# Altium project DUTBoard.PrjPcb (part 1 of 5)
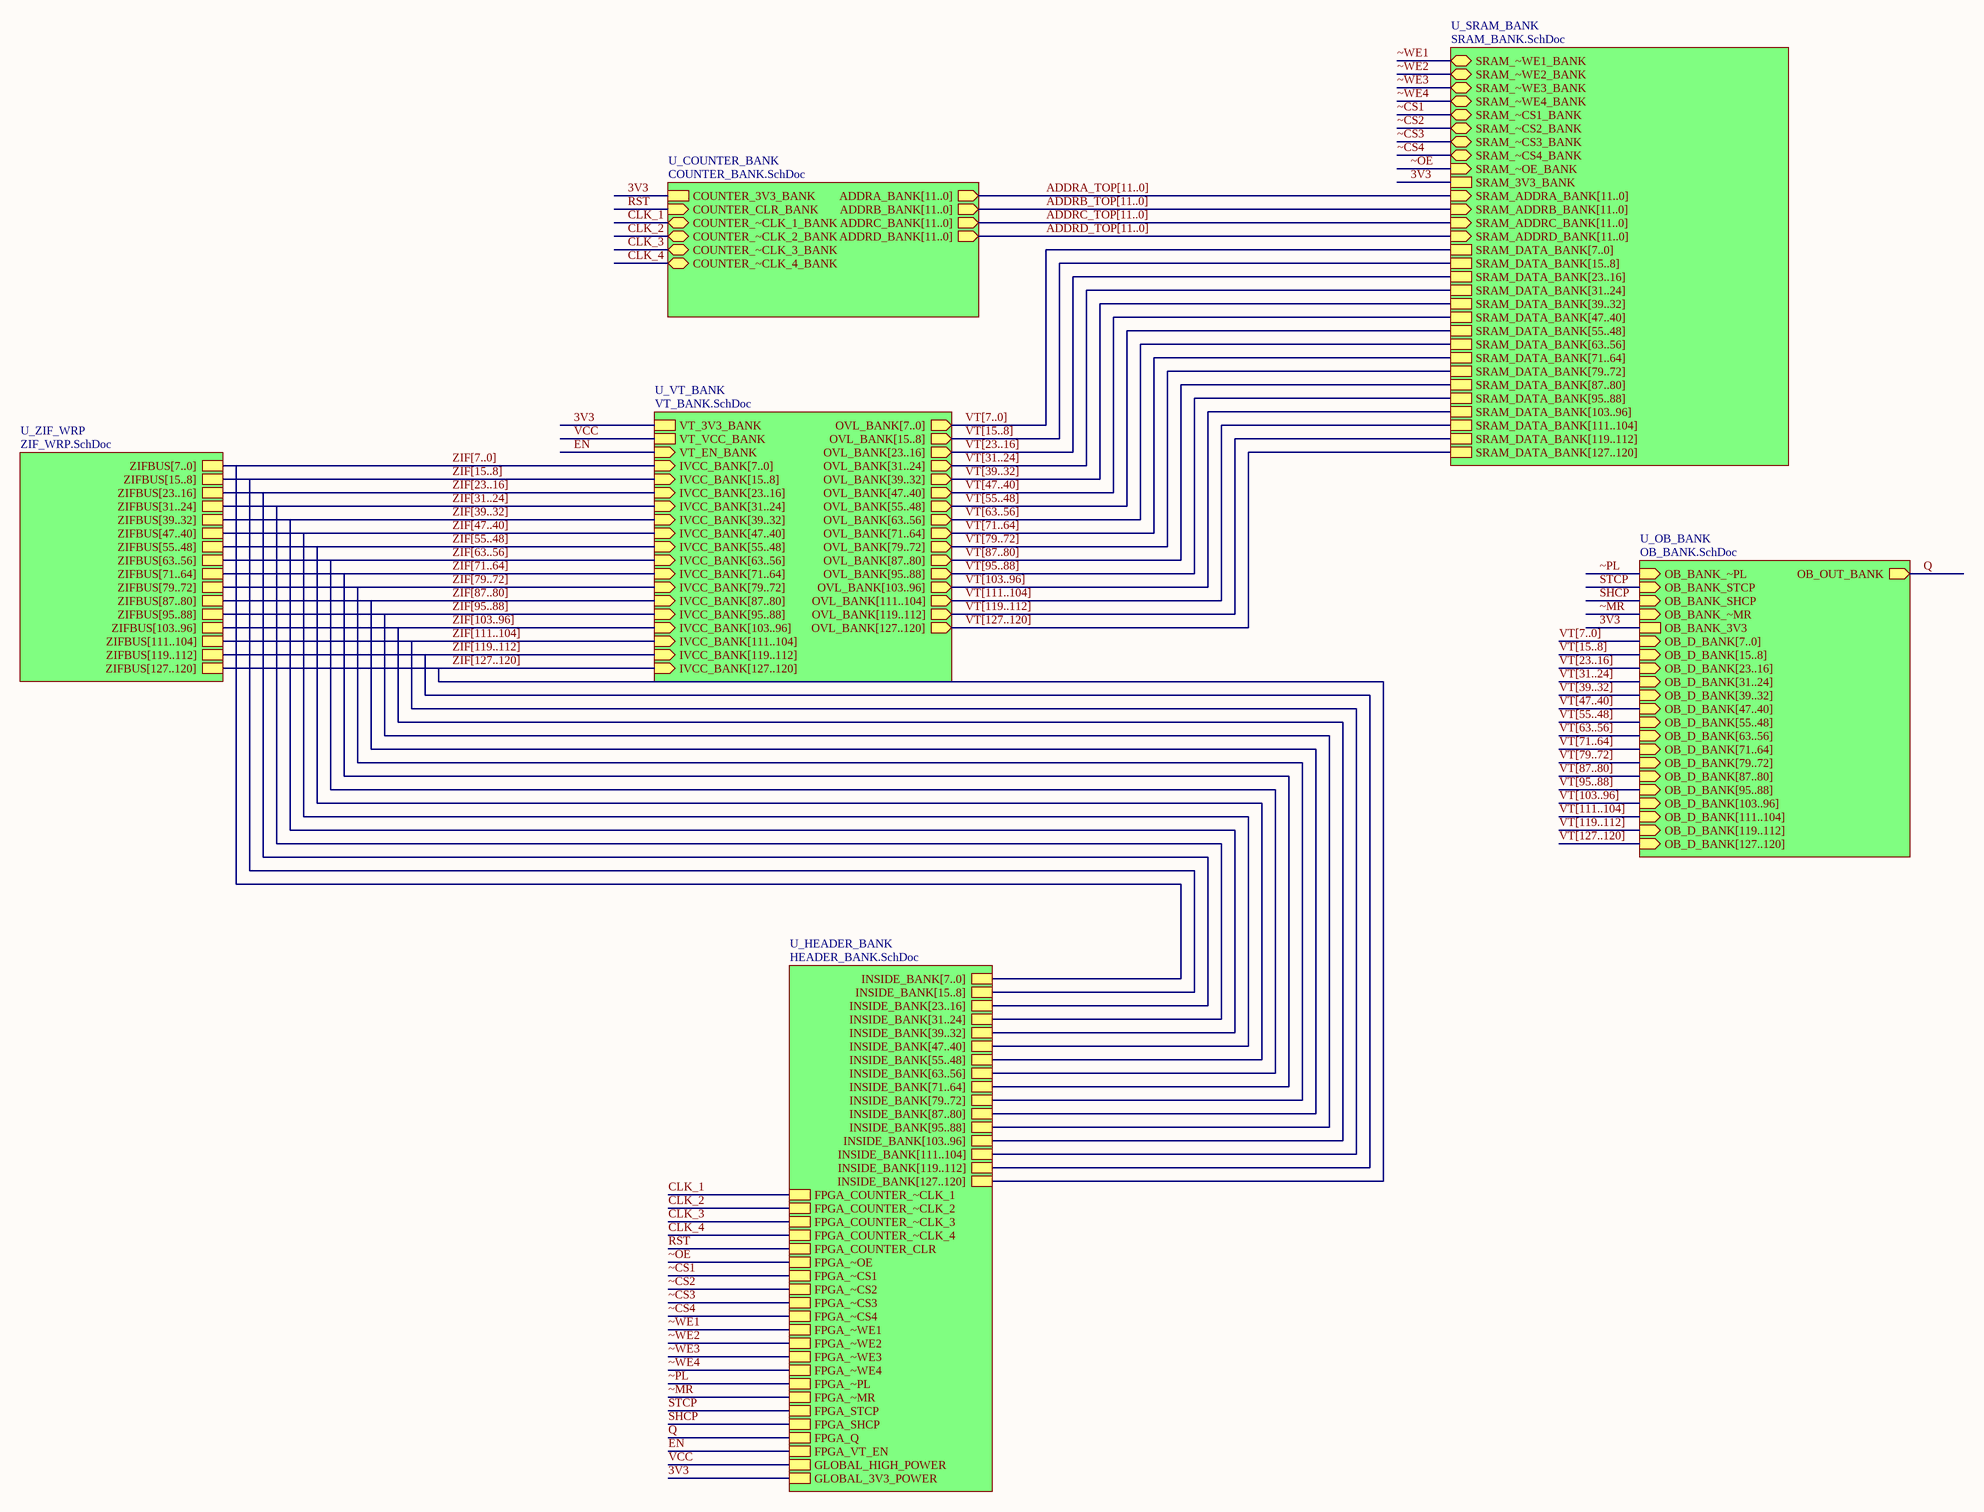
[diagram p0: TOP.SchDoc]
14 sheets, 89 parts. Net scope: hierarchical (ports join the sheet entries above them; power ports are global).
Board file: DUTBoard.PcbDoc
Sheets:
  TOP.SchDoc
    U_COUNTER_BANK = COUNTER_BANK.SchDoc
      U_COUNTER_WRP = COUNTER_WRP.SchDoc
      U_COUNTER_WRP = COUNTER_WRP.SchDoc
      U_COUNTER_WRP = COUNTER_WRP.SchDoc
      U_COUNTER_WRP = COUNTER_WRP.SchDoc
    U_VT_BANK = VT_BANK.SchDoc
      U_VT_WRP = VT_WRP.SchDoc
      U_VT_WRP = VT_WRP.SchDoc
      U_VT_WRP = VT_WRP.SchDoc
      U_VT_WRP = VT_WRP.SchDoc
      U_VT_WRP = VT_WRP.SchDoc
      U_VT_WRP = VT_WRP.SchDoc
      U_VT_WRP = VT_WRP.SchDoc
      U_VT_WRP = VT_WRP.SchDoc
      U_VT_WRP = VT_WRP.SchDoc
      U_VT_WRP = VT_WRP.SchDoc
      U_VT_WRP = VT_WRP.SchDoc
      U_VT_WRP = VT_WRP.SchDoc
      U_VT_WRP = VT_WRP.SchDoc
      U_VT_WRP = VT_WRP.SchDoc
      U_VT_WRP = VT_WRP.SchDoc
      U_VT_WRP = VT_WRP.SchDoc
    U_OB_BANK = OB_BANK.SchDoc
      U_OB_WRP = OB_WRP.SchDoc
      U_OB_WRP = OB_WRP.SchDoc
      U_OB_WRP = OB_WRP.SchDoc
      U_OB_WRP = OB_WRP.SchDoc
      U_OB_WRP = OB_WRP.SchDoc
      U_OB_WRP = OB_WRP.SchDoc
      U_OB_WRP = OB_WRP.SchDoc
      U_OB_WRP = OB_WRP.SchDoc
      U_OB_WRP = OB_WRP.SchDoc
      U_OB_WRP = OB_WRP.SchDoc
      U_OB_WRP = OB_WRP.SchDoc
      U_OB_WRP = OB_WRP.SchDoc
      U_OB_WRP = OB_WRP.SchDoc
      U_OB_WRP = OB_WRP.SchDoc
      U_OB_WRP = OB_WRP.SchDoc
      U_OB_WRP = OB_WRP.SchDoc
    U_SRAM_BANK = SRAM_BANK.SchDoc
      U_SRAM_WRP = SRAM_WRP.SchDoc
      U_SRAM_WRP = SRAM_WRP.SchDoc
      U_SRAM_WRP = SRAM_WRP.SchDoc
      U_SRAM_WRP = SRAM_WRP.SchDoc
      U_SRAM_WRP = SRAM_WRP.SchDoc
      U_SRAM_WRP = SRAM_WRP.SchDoc
      U_SRAM_WRP = SRAM_WRP.SchDoc
      U_SRAM_WRP = SRAM_WRP.SchDoc
    U_ZIF_WRP = ZIF_WRP.SchDoc
    U_HEADER_BANK = HEADER_BANK.SchDoc
      U_COMBINED_HEADER_WRP = COMBINED_HEADER_WRP.SchDoc
        U_TOP_HEADER_WRP = TOP_HEADER_WRP.SchDoc
        U_TOP_HEADER_WRP = TOP_HEADER_WRP.SchDoc
        U_BOTTOM_HEADER_WRP = BOTTOM_HEADER_WRP.SchDoc
      U_COMBINED_HEADER_WRP = COMBINED_HEADER_WRP.SchDoc
        U_TOP_HEADER_WRP = TOP_HEADER_WRP.SchDoc
        U_TOP_HEADER_WRP = TOP_HEADER_WRP.SchDoc
        U_BOTTOM_HEADER_WRP = BOTTOM_HEADER_WRP.SchDoc
      U_COMBINED_HEADER_WRP = COMBINED_HEADER_WRP.SchDoc
        U_TOP_HEADER_WRP = TOP_HEADER_WRP.SchDoc
        U_TOP_HEADER_WRP = TOP_HEADER_WRP.SchDoc
        U_BOTTOM_HEADER_WRP = BOTTOM_HEADER_WRP.SchDoc
      U_COMBINED_HEADER_WRP = COMBINED_HEADER_WRP.SchDoc
        U_TOP_HEADER_WRP = TOP_HEADER_WRP.SchDoc
        U_TOP_HEADER_WRP = TOP_HEADER_WRP.SchDoc
        U_BOTTOM_HEADER_WRP = BOTTOM_HEADER_WRP.SchDoc

## Sheet TOP.SchDoc
size C; DocumentNumber: 1; SheetNumber: 1; SheetTotal: 13

### Sub-sheets
U_COUNTER_BANK = COUNTER_BANK.SchDoc: ADDRA_BANK[11..0], ADDRB_BANK[11..0], ADDRC_BANK[11..0], ADDRD_BANK[11..0], COUNTER_3V3_BANK, COUNTER_CLR_BANK, COUNTER_~CLK_3_BANK, COUNTER_~CLK_2_BANK, COUNTER_~CLK_1_BANK, COUNTER_~CLK_4_BANK
U_HEADER_BANK = HEADER_BANK.SchDoc: INSIDE_BANK[7..0], INSIDE_BANK[15..8], INSIDE_BANK[23..16], INSIDE_BANK[31..24], INSIDE_BANK[39..32], INSIDE_BANK[47..40], INSIDE_BANK[55..48], INSIDE_BANK[63..56], INSIDE_BANK[71..64], INSIDE_BANK[79..72], INSIDE_BANK[87..80], INSIDE_BANK[95..88], INSIDE_BANK[103..96], INSIDE_BANK[111..104], INSIDE_BANK[119..112], INSIDE_BANK[127..120], FPGA_COUNTER_~CLK_2, FPGA_COUNTER_~CLK_3, FPGA_COUNTER_~CLK_4, FPGA_~CS1, FPGA_~OE, FPGA_~WE1, FPGA_~PL, FPGA_~MR, FPGA_STCP, FPGA_SHCP, FPGA_VT_EN, GLOBAL_HIGH_POWER, GLOBAL_3V3_POWER, FPGA_Q, FPGA_~CS2, FPGA_~WE2, FPGA_~CS3, FPGA_~WE3, FPGA_~CS4, FPGA_~WE4, FPGA_COUNTER_~CLK_1, FPGA_COUNTER_CLR
U_OB_BANK = OB_BANK.SchDoc: OB_OUT_BANK, OB_BANK_~PL, OB_BANK_STCP, OB_BANK_SHCP, OB_BANK_~MR, OB_BANK_3V3, OB_D_BANK[7..0], OB_D_BANK[15..8], OB_D_BANK[23..16], OB_D_BANK[31..24], OB_D_BANK[39..32], OB_D_BANK[47..40], OB_D_BANK[55..48], OB_D_BANK[63..56], OB_D_BANK[71..64], OB_D_BANK[79..72], OB_D_BANK[87..80], OB_D_BANK[95..88], OB_D_BANK[103..96], OB_D_BANK[111..104], OB_D_BANK[119..112], OB_D_BANK[127..120]
U_SRAM_BANK = SRAM_BANK.SchDoc: SRAM_~OE_BANK, SRAM_3V3_BANK, SRAM_ADDRA_BANK[11..0], SRAM_ADDRB_BANK[11..0], SRAM_ADDRC_BANK[11..0], SRAM_ADDRD_BANK[11..0], SRAM_DATA_BANK[7..0], SRAM_DATA_BANK[23..16], SRAM_DATA_BANK[39..32], SRAM_DATA_BANK[55..48], SRAM_DATA_BANK[71..64], SRAM_DATA_BANK[87..80], SRAM_DATA_BANK[103..96], SRAM_DATA_BANK[119..112], SRAM_DATA_BANK[15..8], SRAM_DATA_BANK[31..24], SRAM_DATA_BANK[47..40], SRAM_DATA_BANK[63..56], SRAM_DATA_BANK[79..72], SRAM_DATA_BANK[95..88], SRAM_DATA_BANK[111..104], SRAM_DATA_BANK[127..120], SRAM_~CS3_BANK, SRAM_~WE2_BANK, SRAM_~WE3_BANK, SRAM_~WE1_BANK, SRAM_~WE4_BANK, SRAM_~CS4_BANK, SRAM_~CS1_BANK, SRAM_~CS2_BANK
U_VT_BANK = VT_BANK.SchDoc: VT_3V3_BANK, VT_VCC_BANK, VT_EN_BANK, OVL_BANK[7..0], OVL_BANK[15..8], OVL_BANK[23..16], OVL_BANK[31..24], OVL_BANK[39..32], OVL_BANK[47..40], OVL_BANK[55..48], OVL_BANK[63..56], OVL_BANK[71..64], OVL_BANK[79..72], OVL_BANK[87..80], OVL_BANK[95..88], OVL_BANK[103..96], OVL_BANK[111..104], OVL_BANK[119..112], OVL_BANK[127..120], IVCC_BANK[7..0], IVCC_BANK[15..8], IVCC_BANK[23..16], IVCC_BANK[31..24], IVCC_BANK[39..32], IVCC_BANK[47..40], IVCC_BANK[55..48], IVCC_BANK[63..56], IVCC_BANK[71..64], IVCC_BANK[79..72], IVCC_BANK[87..80], IVCC_BANK[95..88], IVCC_BANK[103..96], IVCC_BANK[111..104], IVCC_BANK[119..112], IVCC_BANK[127..120]
U_ZIF_WRP = ZIF_WRP.SchDoc: ZIFBUS[7..0], ZIFBUS[15..8], ZIFBUS[23..16], ZIFBUS[31..24], ZIFBUS[71..64], ZIFBUS[79..72], ZIFBUS[87..80], ZIFBUS[95..88], ZIFBUS[103..96], ZIFBUS[111..104], ZIFBUS[119..112], ZIFBUS[127..120], ZIFBUS[39..32], ZIFBUS[47..40], ZIFBUS[55..48], ZIFBUS[63..56]

### Nets
3V3: sheet U_COUNTER_BANK/COUNTER_3V3_BANK, sheet U_VT_BANK/VT_3V3_BANK, sheet U_OB_BANK/OB_BANK_3V3, sheet U_SRAM_BANK/SRAM_3V3_BANK, sheet U_HEADER_BANK/GLOBAL_3V3_POWER
CLK_1: sheet U_COUNTER_BANK/COUNTER_~CLK_1_BANK, sheet U_HEADER_BANK/FPGA_COUNTER_~CLK_1
CLK_2: sheet U_COUNTER_BANK/COUNTER_~CLK_2_BANK, sheet U_HEADER_BANK/FPGA_COUNTER_~CLK_2
CLK_3: sheet U_COUNTER_BANK/COUNTER_~CLK_3_BANK, sheet U_HEADER_BANK/FPGA_COUNTER_~CLK_3
CLK_4: sheet U_COUNTER_BANK/COUNTER_~CLK_4_BANK, sheet U_HEADER_BANK/FPGA_COUNTER_~CLK_4
EN: sheet U_VT_BANK/VT_EN_BANK, sheet U_HEADER_BANK/FPGA_VT_EN
Q: sheet U_OB_BANK/OB_OUT_BANK, sheet U_HEADER_BANK/FPGA_Q  [project net FPGA_Q]
RST: sheet U_COUNTER_BANK/COUNTER_CLR_BANK, sheet U_HEADER_BANK/FPGA_COUNTER_CLR  [project net CLR_COUNTER_W]
SHCP: sheet U_OB_BANK/OB_BANK_SHCP, sheet U_HEADER_BANK/FPGA_SHCP  [project net FPGA_SHCP]
STCP: sheet U_OB_BANK/OB_BANK_STCP, sheet U_HEADER_BANK/FPGA_STCP  [project net FPGA_STCP]
VCC: sheet U_VT_BANK/VT_VCC_BANK, sheet U_HEADER_BANK/GLOBAL_HIGH_POWER  [project net GLOBAL_HIGH_POWER]
~CS1: sheet U_SRAM_BANK/SRAM_~CS1_BANK, sheet U_HEADER_BANK/FPGA_~CS1  [project net FPGA_~CS1]
~CS2: sheet U_SRAM_BANK/SRAM_~CS2_BANK, sheet U_HEADER_BANK/FPGA_~CS2  [project net FPGA_~CS2]
~CS3: sheet U_SRAM_BANK/SRAM_~CS3_BANK, sheet U_HEADER_BANK/FPGA_~CS3  [project net FPGA_~CS3]
~CS4: sheet U_SRAM_BANK/SRAM_~CS4_BANK, sheet U_HEADER_BANK/FPGA_~CS4  [project net FPGA_~CS4]
~MR: sheet U_OB_BANK/OB_BANK_~MR, sheet U_HEADER_BANK/FPGA_~MR  [project net FPGA_~MR]
~OE: sheet U_SRAM_BANK/SRAM_~OE_BANK, sheet U_HEADER_BANK/FPGA_~OE  [project net FPGA_~OE]
~PL: sheet U_OB_BANK/OB_BANK_~PL, sheet U_HEADER_BANK/FPGA_~PL  [project net FPGA_~PL]
~WE1: sheet U_SRAM_BANK/SRAM_~WE1_BANK, sheet U_HEADER_BANK/FPGA_~WE1  [project net FPGA_~WE1]
~WE2: sheet U_SRAM_BANK/SRAM_~WE2_BANK, sheet U_HEADER_BANK/FPGA_~WE2  [project net FPGA_~WE2]
~WE3: sheet U_SRAM_BANK/SRAM_~WE3_BANK, sheet U_HEADER_BANK/FPGA_~WE3  [project net FPGA_~WE3]
~WE4: sheet U_SRAM_BANK/SRAM_~WE4_BANK, sheet U_HEADER_BANK/FPGA_~WE4  [project net FPGA_~WE4]

### Buses and harness runs
bus ADDRA_TOP[11..0] = sheet U_COUNTER_BANK/ADDRA_BANK[11..0] = sheet U_SRAM_BANK/SRAM_ADDRA_BANK[11..0]
bus ADDRB_TOP[11..0] = sheet U_COUNTER_BANK/ADDRB_BANK[11..0] = sheet U_SRAM_BANK/SRAM_ADDRB_BANK[11..0]
bus ADDRC_TOP[11..0] = sheet U_COUNTER_BANK/ADDRC_BANK[11..0] = sheet U_SRAM_BANK/SRAM_ADDRC_BANK[11..0]
bus ADDRD_TOP[11..0] = sheet U_COUNTER_BANK/ADDRD_BANK[11..0] = sheet U_SRAM_BANK/SRAM_ADDRD_BANK[11..0]
bus VT[7..0] = sheet U_OB_BANK/OB_D_BANK[7..0]
bus VT[7..0] = sheet U_SRAM_BANK/SRAM_DATA_BANK[7..0] = sheet U_VT_BANK/OVL_BANK[7..0]
bus VT[15..8] = sheet U_OB_BANK/OB_D_BANK[15..8]
bus VT[15..8] = sheet U_SRAM_BANK/SRAM_DATA_BANK[15..8] = sheet U_VT_BANK/OVL_BANK[15..8]
bus VT[23..16] = sheet U_OB_BANK/OB_D_BANK[23..16]
bus VT[23..16] = sheet U_SRAM_BANK/SRAM_DATA_BANK[23..16] = sheet U_VT_BANK/OVL_BANK[23..16]
bus VT[31..24] = sheet U_OB_BANK/OB_D_BANK[31..24]
bus VT[31..24] = sheet U_SRAM_BANK/SRAM_DATA_BANK[31..24] = sheet U_VT_BANK/OVL_BANK[31..24]
bus VT[39..32] = sheet U_OB_BANK/OB_D_BANK[39..32]
bus VT[39..32] = sheet U_SRAM_BANK/SRAM_DATA_BANK[39..32] = sheet U_VT_BANK/OVL_BANK[39..32]
bus VT[47..40] = sheet U_OB_BANK/OB_D_BANK[47..40]
bus VT[47..40] = sheet U_SRAM_BANK/SRAM_DATA_BANK[47..40] = sheet U_VT_BANK/OVL_BANK[47..40]
bus VT[55..48] = sheet U_OB_BANK/OB_D_BANK[55..48]
bus VT[55..48] = sheet U_SRAM_BANK/SRAM_DATA_BANK[55..48] = sheet U_VT_BANK/OVL_BANK[55..48]
bus VT[63..56] = sheet U_OB_BANK/OB_D_BANK[63..56]
bus VT[63..56] = sheet U_SRAM_BANK/SRAM_DATA_BANK[63..56] = sheet U_VT_BANK/OVL_BANK[63..56]
bus VT[71..64] = sheet U_OB_BANK/OB_D_BANK[71..64]
bus VT[71..64] = sheet U_SRAM_BANK/SRAM_DATA_BANK[71..64] = sheet U_VT_BANK/OVL_BANK[71..64]
bus VT[79..72] = sheet U_OB_BANK/OB_D_BANK[79..72]
bus VT[79..72] = sheet U_SRAM_BANK/SRAM_DATA_BANK[79..72] = sheet U_VT_BANK/OVL_BANK[79..72]
bus VT[87..80] = sheet U_OB_BANK/OB_D_BANK[87..80]
bus VT[87..80] = sheet U_SRAM_BANK/SRAM_DATA_BANK[87..80] = sheet U_VT_BANK/OVL_BANK[87..80]
bus VT[95..88] = sheet U_OB_BANK/OB_D_BANK[95..88]
bus VT[95..88] = sheet U_SRAM_BANK/SRAM_DATA_BANK[95..88] = sheet U_VT_BANK/OVL_BANK[95..88]
bus VT[103..96] = sheet U_OB_BANK/OB_D_BANK[103..96]
bus VT[103..96] = sheet U_SRAM_BANK/SRAM_DATA_BANK[103..96] = sheet U_VT_BANK/OVL_BANK[103..96]
bus VT[111..104] = sheet U_OB_BANK/OB_D_BANK[111..104]
bus VT[111..104] = sheet U_SRAM_BANK/SRAM_DATA_BANK[111..104] = sheet U_VT_BANK/OVL_BANK[111..104]
bus VT[119..112] = sheet U_OB_BANK/OB_D_BANK[119..112]
bus VT[119..112] = sheet U_SRAM_BANK/SRAM_DATA_BANK[119..112] = sheet U_VT_BANK/OVL_BANK[119..112]
bus VT[127..120] = sheet U_OB_BANK/OB_D_BANK[127..120]
bus VT[127..120] = sheet U_SRAM_BANK/SRAM_DATA_BANK[127..120] = sheet U_VT_BANK/OVL_BANK[127..120]
bus ZIF[7..0] = sheet U_HEADER_BANK/INSIDE_BANK[7..0] = sheet U_VT_BANK/IVCC_BANK[7..0] = sheet U_ZIF_WRP/ZIFBUS[7..0]
bus ZIF[15..8] = sheet U_HEADER_BANK/INSIDE_BANK[15..8] = sheet U_VT_BANK/IVCC_BANK[15..8] = sheet U_ZIF_WRP/ZIFBUS[15..8]
bus ZIF[23..16] = sheet U_HEADER_BANK/INSIDE_BANK[23..16] = sheet U_VT_BANK/IVCC_BANK[23..16] = sheet U_ZIF_WRP/ZIFBUS[23..16]
bus ZIF[31..24] = sheet U_HEADER_BANK/INSIDE_BANK[31..24] = sheet U_VT_BANK/IVCC_BANK[31..24] = sheet U_ZIF_WRP/ZIFBUS[31..24]
bus ZIF[39..32] = sheet U_HEADER_BANK/INSIDE_BANK[39..32] = sheet U_VT_BANK/IVCC_BANK[39..32] = sheet U_ZIF_WRP/ZIFBUS[39..32]
bus ZIF[47..40] = sheet U_HEADER_BANK/INSIDE_BANK[47..40] = sheet U_VT_BANK/IVCC_BANK[47..40] = sheet U_ZIF_WRP/ZIFBUS[47..40]
bus ZIF[55..48] = sheet U_HEADER_BANK/INSIDE_BANK[55..48] = sheet U_VT_BANK/IVCC_BANK[55..48] = sheet U_ZIF_WRP/ZIFBUS[55..48]
bus ZIF[63..56] = sheet U_HEADER_BANK/INSIDE_BANK[63..56] = sheet U_VT_BANK/IVCC_BANK[63..56] = sheet U_ZIF_WRP/ZIFBUS[63..56]
bus ZIF[71..64] = sheet U_HEADER_BANK/INSIDE_BANK[71..64] = sheet U_VT_BANK/IVCC_BANK[71..64] = sheet U_ZIF_WRP/ZIFBUS[71..64]
bus ZIF[79..72] = sheet U_HEADER_BANK/INSIDE_BANK[79..72] = sheet U_VT_BANK/IVCC_BANK[79..72] = sheet U_ZIF_WRP/ZIFBUS[79..72]
bus ZIF[87..80] = sheet U_HEADER_BANK/INSIDE_BANK[87..80] = sheet U_VT_BANK/IVCC_BANK[87..80] = sheet U_ZIF_WRP/ZIFBUS[87..80]
bus ZIF[95..88] = sheet U_HEADER_BANK/INSIDE_BANK[95..88] = sheet U_VT_BANK/IVCC_BANK[95..88] = sheet U_ZIF_WRP/ZIFBUS[95..88]
bus ZIF[103..96] = sheet U_HEADER_BANK/INSIDE_BANK[103..96] = sheet U_VT_BANK/IVCC_BANK[103..96] = sheet U_ZIF_WRP/ZIFBUS[103..96]
bus ZIF[111..104] = sheet U_HEADER_BANK/INSIDE_BANK[111..104] = sheet U_VT_BANK/IVCC_BANK[111..104] = sheet U_ZIF_WRP/ZIFBUS[111..104]
bus ZIF[119..112] = sheet U_HEADER_BANK/INSIDE_BANK[119..112] = sheet U_VT_BANK/IVCC_BANK[119..112] = sheet U_ZIF_WRP/ZIFBUS[119..112]
bus ZIF[127..120] = sheet U_HEADER_BANK/INSIDE_BANK[127..120] = sheet U_VT_BANK/IVCC_BANK[127..120] = sheet U_ZIF_WRP/ZIFBUS[127..120]

## Sheet COUNTER_BANK.SchDoc
size A; DocumentNumber: 10; SheetNumber: 10; SheetTotal: 13
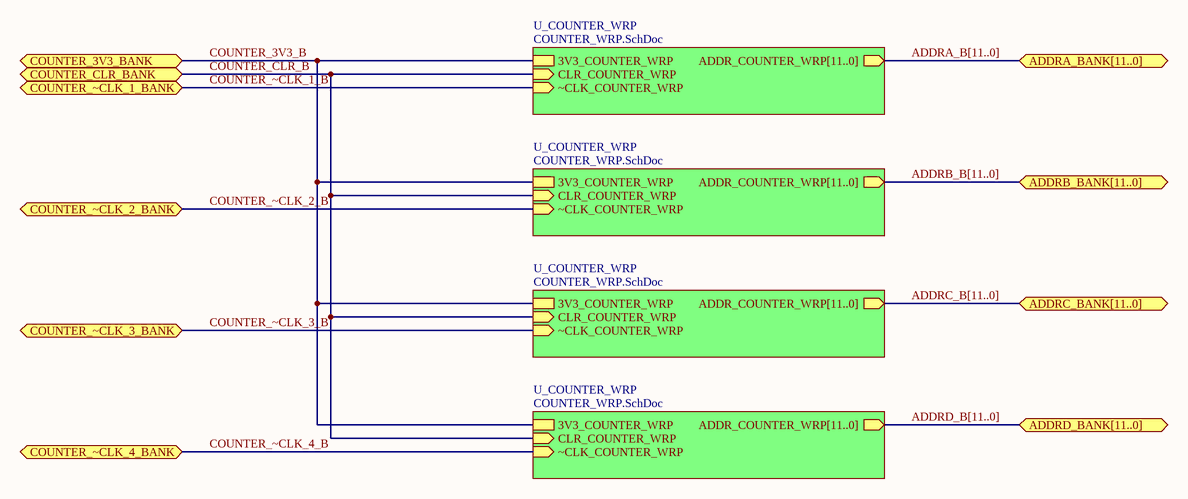
[diagram p1: COUNTER_BANK.SchDoc]

### Sub-sheets
U_COUNTER_WRP = COUNTER_WRP.SchDoc: ADDR_COUNTER_WRP[11..0], 3V3_COUNTER_WRP, CLR_COUNTER_WRP, ~CLK_COUNTER_WRP
U_COUNTER_WRP = COUNTER_WRP.SchDoc: ADDR_COUNTER_WRP[11..0], 3V3_COUNTER_WRP, CLR_COUNTER_WRP, ~CLK_COUNTER_WRP
U_COUNTER_WRP = COUNTER_WRP.SchDoc: ADDR_COUNTER_WRP[11..0], 3V3_COUNTER_WRP, CLR_COUNTER_WRP, ~CLK_COUNTER_WRP
U_COUNTER_WRP = COUNTER_WRP.SchDoc: ADDR_COUNTER_WRP[11..0], 3V3_COUNTER_WRP, CLR_COUNTER_WRP, ~CLK_COUNTER_WRP

### Ports
ADDRA_BANK[11..0], ADDRB_BANK[11..0], ADDRC_BANK[11..0], ADDRD_BANK[11..0], COUNTER_3V3_BANK, COUNTER_CLR_BANK, COUNTER_~CLK_1_BANK, COUNTER_~CLK_2_BANK, COUNTER_~CLK_3_BANK, COUNTER_~CLK_4_BANK

### Nets
COUNTER_3V3_B: port COUNTER_3V3_BANK, sheet U_COUNTER_WRP/3V3_COUNTER_WRP, sheet U_COUNTER_WRP/3V3_COUNTER_WRP, sheet U_COUNTER_WRP/3V3_COUNTER_WRP, sheet U_COUNTER_WRP/3V3_COUNTER_WRP  [project net 3V3]
COUNTER_CLR_B: port COUNTER_CLR_BANK, sheet U_COUNTER_WRP/CLR_COUNTER_WRP, sheet U_COUNTER_WRP/CLR_COUNTER_WRP, sheet U_COUNTER_WRP/CLR_COUNTER_WRP, sheet U_COUNTER_WRP/CLR_COUNTER_WRP  [project net CLR_COUNTER_W]
COUNTER_~CLK_1_B: port COUNTER_~CLK_1_BANK, sheet U_COUNTER_WRP/~CLK_COUNTER_WRP  [project net CLK_1]
COUNTER_~CLK_2_B: port COUNTER_~CLK_2_BANK, sheet U_COUNTER_WRP/~CLK_COUNTER_WRP  [project net CLK_2]
COUNTER_~CLK_3_B: port COUNTER_~CLK_3_BANK, sheet U_COUNTER_WRP/~CLK_COUNTER_WRP  [project net CLK_3]
COUNTER_~CLK_4_B: port COUNTER_~CLK_4_BANK, sheet U_COUNTER_WRP/~CLK_COUNTER_WRP  [project net CLK_4]

### Buses and harness runs
bus ADDRA_B[11..0] = port ADDRA_BANK[11..0] = sheet U_COUNTER_WRP/ADDR_COUNTER_WRP[11..0]
bus ADDRB_B[11..0] = port ADDRB_BANK[11..0] = sheet U_COUNTER_WRP/ADDR_COUNTER_WRP[11..0]
bus ADDRC_B[11..0] = port ADDRC_BANK[11..0] = sheet U_COUNTER_WRP/ADDR_COUNTER_WRP[11..0]
bus ADDRD_B[11..0] = port ADDRD_BANK[11..0] = sheet U_COUNTER_WRP/ADDR_COUNTER_WRP[11..0]

## Sheet COUNTER_WRP.SchDoc
size A; DocumentNumber: 6; SheetNumber: 6; SheetTotal: 13
Used 4 times, as channels U_COUNTER_BANK/U_COUNTER_WRP, U_COUNTER_BANK/U_COUNTER_WRP, U_COUNTER_BANK/U_COUNTER_WRP, U_COUNTER_BANK/U_COUNTER_WRP. Parts and nets are listed once, with the designators drawn on the sheet.
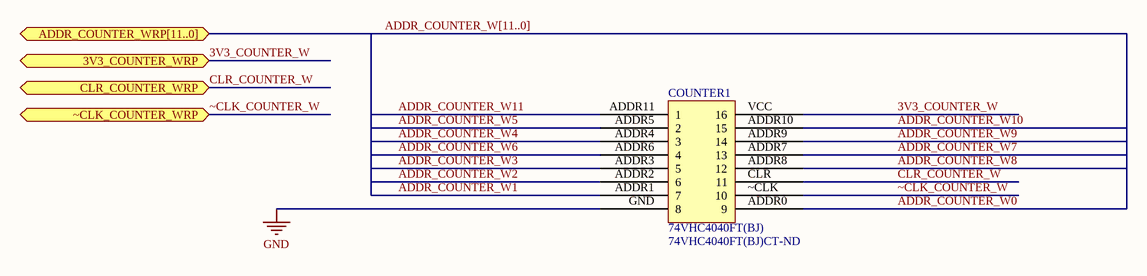
[diagram p2: COUNTER_WRP.SchDoc]

### Parts
COUNTER1  74VHC4040FT(BJ)  Supplier Part Number 1: 74VHC4040FT(BJ)CT-ND  [COUNTER_TSSOP16]

### Ports
3V3_COUNTER_WRP, ADDR_COUNTER_WRP[11..0], CLR_COUNTER_WRP, ~CLK_COUNTER_WRP

### Nets
GND: COUNTER1.GND(8)
3V3_COUNTER_W: COUNTER1.VCC(16) ; port 3V3_COUNTER_WRP
ADDR_COUNTER_W0: COUNTER1.ADDR0(9)
ADDR_COUNTER_W1: COUNTER1.ADDR1(7)
ADDR_COUNTER_W2: COUNTER1.ADDR2(6)
ADDR_COUNTER_W3: COUNTER1.ADDR3(5)
ADDR_COUNTER_W4: COUNTER1.ADDR4(3)
ADDR_COUNTER_W5: COUNTER1.ADDR5(2)
ADDR_COUNTER_W6: COUNTER1.ADDR6(4)
ADDR_COUNTER_W7: COUNTER1.ADDR7(13)
ADDR_COUNTER_W8: COUNTER1.ADDR8(12)
ADDR_COUNTER_W9: COUNTER1.ADDR9(14)
ADDR_COUNTER_W10: COUNTER1.ADDR10(15)
ADDR_COUNTER_W11: COUNTER1.ADDR11(1)
CLR_COUNTER_W: COUNTER1.CLR(11) ; port CLR_COUNTER_WRP
~CLK_COUNTER_W: COUNTER1.~CLK(10) ; port ~CLK_COUNTER_WRP

### Channels
U_COUNTER_BANK/U_COUNTER_WRP: designators COUNTER1=C4; ports 3V3_COUNTER_WRP=3V3 CLR_COUNTER_WRP=CLR_COUNTER_W ~CLK_COUNTER_WRP=CLK_1
U_COUNTER_BANK/U_COUNTER_WRP: designators COUNTER1=C3; ports 3V3_COUNTER_WRP=3V3 CLR_COUNTER_WRP=CLR_COUNTER_W ~CLK_COUNTER_WRP=CLK_2
U_COUNTER_BANK/U_COUNTER_WRP: designators COUNTER1=C2; ports 3V3_COUNTER_WRP=3V3 CLR_COUNTER_WRP=CLR_COUNTER_W ~CLK_COUNTER_WRP=CLK_3
U_COUNTER_BANK/U_COUNTER_WRP: designators COUNTER1=C1; ports 3V3_COUNTER_WRP=3V3 CLR_COUNTER_WRP=CLR_COUNTER_W ~CLK_COUNTER_WRP=CLK_4

### Buses and harness runs
bus ADDR_COUNTER_W[11..0] = port ADDR_COUNTER_WRP[11..0]

### Library data of the parts
COUNTER1 = 74VHC4040FT(BJ): IC COUNTER BIN 12STAGE 16-TSSOP; Manufacturer: Toshiba Semiconductor and Storage; Logic Type: Binary Counter; Direction: Up; Number of Elements: 1; Number of Bits per Element: 12; Reset: Asynchronous; Count Rate: 210MHz; Trigger Type: Negative Edge; Voltage - Supply: 2 V ~ 5.5 V; Supplier 1: Digi-Key; Manufacturer Part Number: 74VHC4040FT(BJ); RoHS: RoHS Compliant; Category: Integrated Circuits (ICs); Stock 1: 4371; Pricing 1: 1=0.54, 10=0.42, 25=0.3544, 100=0.2888, 250=0.2392, 500=0.1976, 1000=0.148 (USD); Packaging: Cut Tape (CT); Timing: -; Operating Temperature: -40°C ~ 85°C; Mounting Type: Surface Mount; Package / Case: 16-TSSOP (0.173", 4.40mm Width); Supplier Device Package: 16-TSSOPB; ComponentLink1URL: http://www.semicon.toshiba.co.jp/info/docget.jsp?type=datasheet&lang=en&pid=74VHC4040FT; ComponentLink1Description: http://www.semicon.toshiba.co.jp/info/docget.jsp?type=datasheet&lang=en&pid=74VHC4040FT

## Sheet VT_BANK.SchDoc
size B; DocumentNumber: 5; SheetNumber: 5; SheetTotal: 13
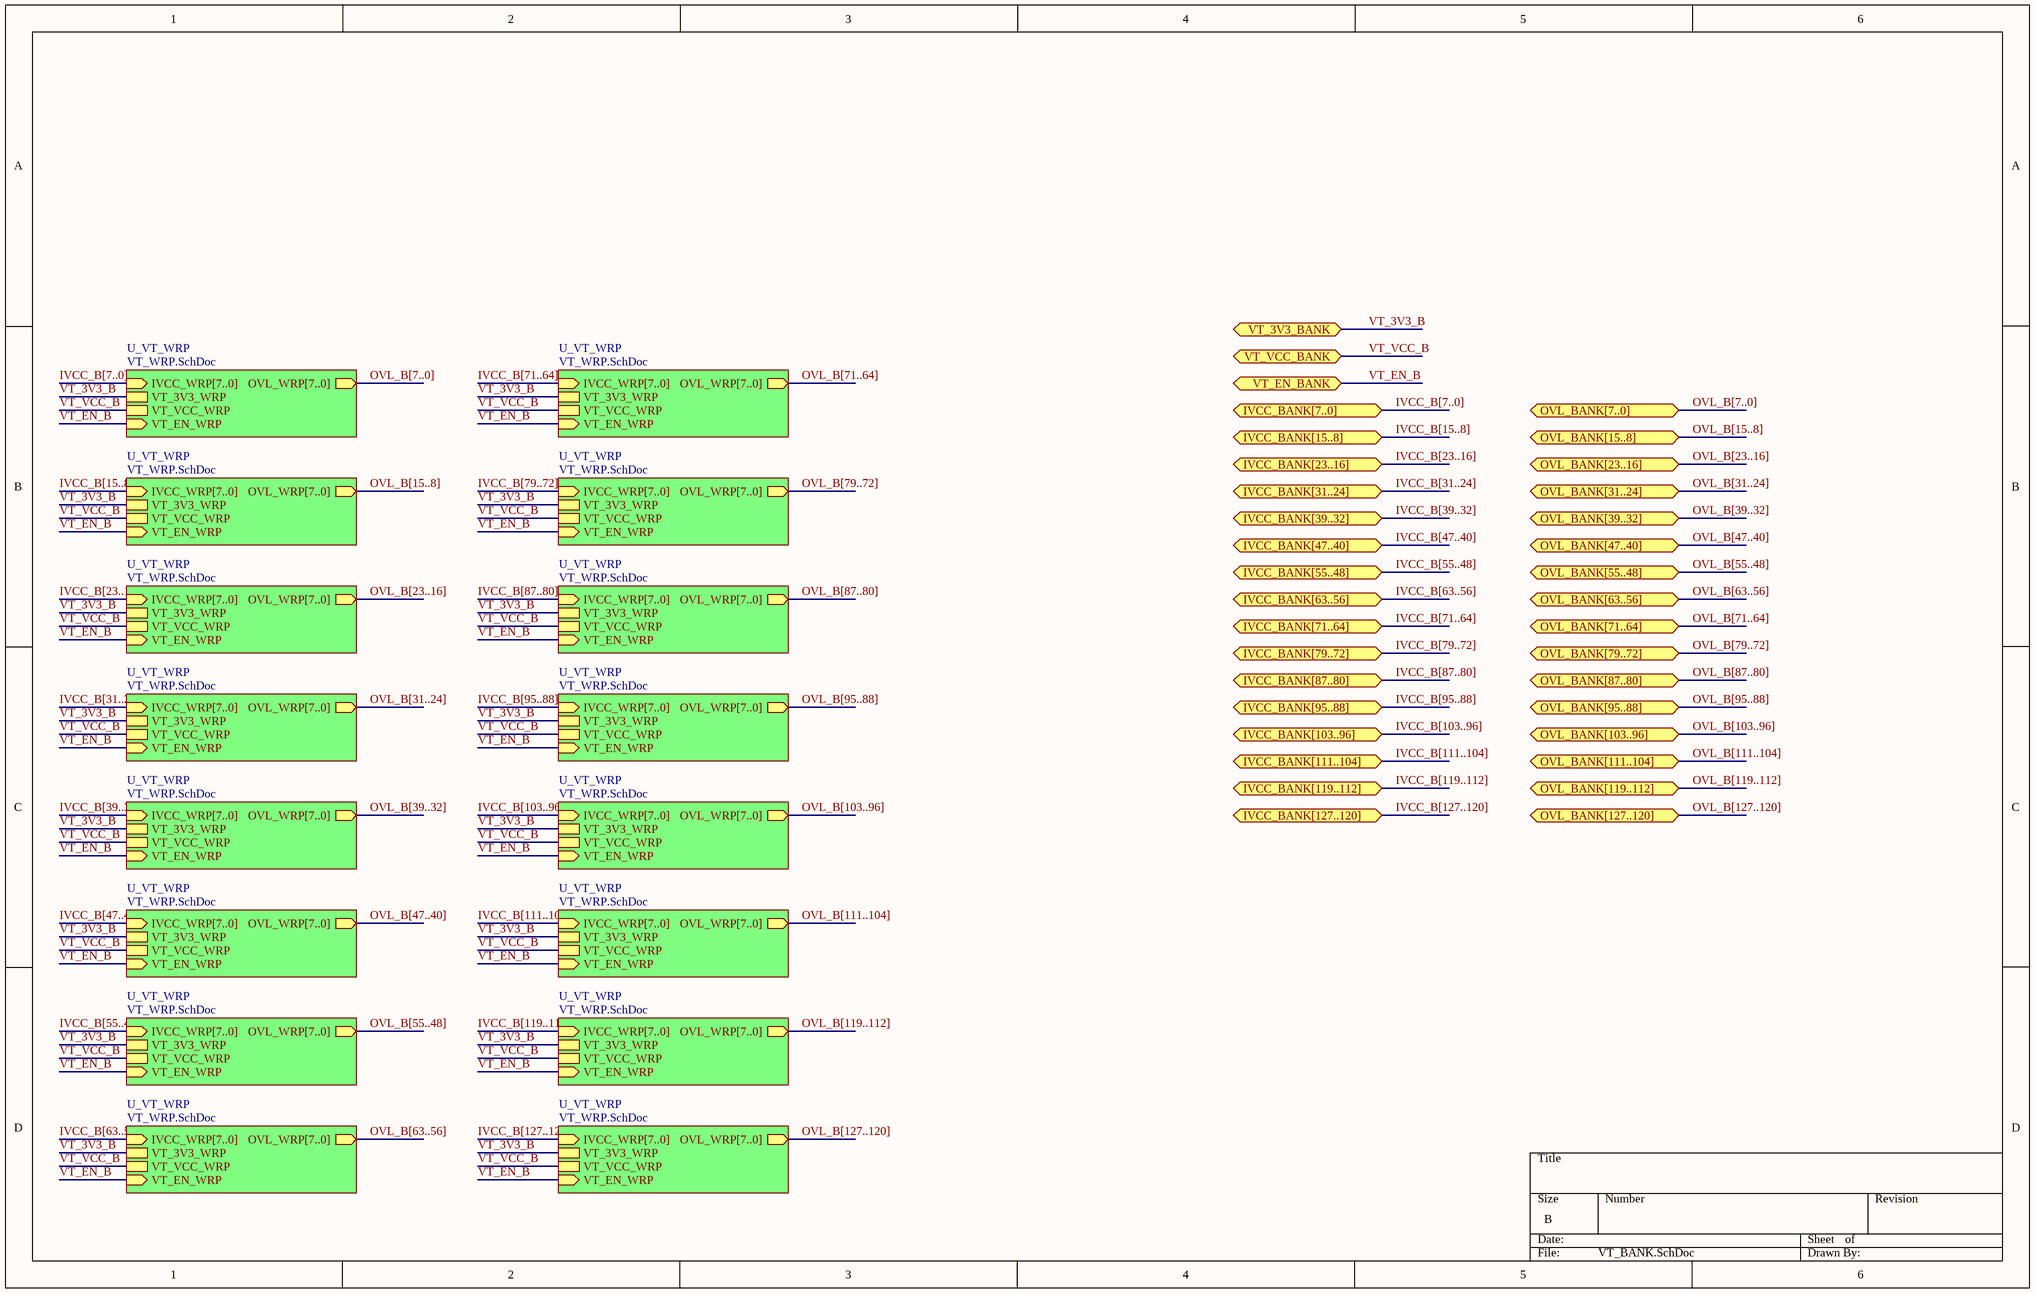
[diagram p3: VT_BANK.SchDoc]

### Sub-sheets
U_VT_WRP = VT_WRP.SchDoc: IVCC_WRP[7..0], OVL_WRP[7..0], VT_3V3_WRP, VT_VCC_WRP, VT_EN_WRP
U_VT_WRP = VT_WRP.SchDoc: IVCC_WRP[7..0], OVL_WRP[7..0], VT_3V3_WRP, VT_VCC_WRP, VT_EN_WRP
U_VT_WRP = VT_WRP.SchDoc: IVCC_WRP[7..0], OVL_WRP[7..0], VT_3V3_WRP, VT_VCC_WRP, VT_EN_WRP
U_VT_WRP = VT_WRP.SchDoc: IVCC_WRP[7..0], OVL_WRP[7..0], VT_3V3_WRP, VT_VCC_WRP, VT_EN_WRP
U_VT_WRP = VT_WRP.SchDoc: IVCC_WRP[7..0], OVL_WRP[7..0], VT_3V3_WRP, VT_VCC_WRP, VT_EN_WRP
U_VT_WRP = VT_WRP.SchDoc: IVCC_WRP[7..0], OVL_WRP[7..0], VT_3V3_WRP, VT_VCC_WRP, VT_EN_WRP
U_VT_WRP = VT_WRP.SchDoc: IVCC_WRP[7..0], OVL_WRP[7..0], VT_3V3_WRP, VT_VCC_WRP, VT_EN_WRP
U_VT_WRP = VT_WRP.SchDoc: IVCC_WRP[7..0], OVL_WRP[7..0], VT_3V3_WRP, VT_VCC_WRP, VT_EN_WRP
U_VT_WRP = VT_WRP.SchDoc: IVCC_WRP[7..0], OVL_WRP[7..0], VT_3V3_WRP, VT_VCC_WRP, VT_EN_WRP
U_VT_WRP = VT_WRP.SchDoc: IVCC_WRP[7..0], OVL_WRP[7..0], VT_3V3_WRP, VT_VCC_WRP, VT_EN_WRP
U_VT_WRP = VT_WRP.SchDoc: IVCC_WRP[7..0], OVL_WRP[7..0], VT_3V3_WRP, VT_VCC_WRP, VT_EN_WRP
U_VT_WRP = VT_WRP.SchDoc: IVCC_WRP[7..0], OVL_WRP[7..0], VT_3V3_WRP, VT_VCC_WRP, VT_EN_WRP
U_VT_WRP = VT_WRP.SchDoc: IVCC_WRP[7..0], OVL_WRP[7..0], VT_3V3_WRP, VT_VCC_WRP, VT_EN_WRP
U_VT_WRP = VT_WRP.SchDoc: IVCC_WRP[7..0], OVL_WRP[7..0], VT_3V3_WRP, VT_VCC_WRP, VT_EN_WRP
U_VT_WRP = VT_WRP.SchDoc: IVCC_WRP[7..0], OVL_WRP[7..0], VT_3V3_WRP, VT_VCC_WRP, VT_EN_WRP
U_VT_WRP = VT_WRP.SchDoc: IVCC_WRP[7..0], OVL_WRP[7..0], VT_3V3_WRP, VT_VCC_WRP, VT_EN_WRP

### Ports
IVCC_BANK[7..0], IVCC_BANK[15..8], IVCC_BANK[23..16], IVCC_BANK[31..24], IVCC_BANK[39..32], IVCC_BANK[47..40], IVCC_BANK[55..48], IVCC_BANK[63..56], IVCC_BANK[71..64], IVCC_BANK[79..72], IVCC_BANK[87..80], IVCC_BANK[95..88], IVCC_BANK[103..96], IVCC_BANK[111..104], IVCC_BANK[119..112], IVCC_BANK[127..120], OVL_BANK[7..0], OVL_BANK[15..8], OVL_BANK[23..16], OVL_BANK[31..24], OVL_BANK[39..32], OVL_BANK[47..40], OVL_BANK[55..48], OVL_BANK[63..56], OVL_BANK[71..64], OVL_BANK[79..72], OVL_BANK[87..80], OVL_BANK[95..88], OVL_BANK[103..96], OVL_BANK[111..104], OVL_BANK[119..112], OVL_BANK[127..120], VT_3V3_BANK, VT_EN_BANK, VT_VCC_BANK

### Nets
VT_3V3_B: port VT_3V3_BANK, sheet U_VT_WRP/VT_3V3_WRP, sheet U_VT_WRP/VT_3V3_WRP, sheet U_VT_WRP/VT_3V3_WRP, sheet U_VT_WRP/VT_3V3_WRP, sheet U_VT_WRP/VT_3V3_WRP, sheet U_VT_WRP/VT_3V3_WRP, sheet U_VT_WRP/VT_3V3_WRP, sheet U_VT_WRP/VT_3V3_WRP, sheet U_VT_WRP/VT_3V3_WRP, sheet U_VT_WRP/VT_3V3_WRP, sheet U_VT_WRP/VT_3V3_WRP, sheet U_VT_WRP/VT_3V3_WRP, sheet U_VT_WRP/VT_3V3_WRP, sheet U_VT_WRP/VT_3V3_WRP, sheet U_VT_WRP/VT_3V3_WRP, sheet U_VT_WRP/VT_3V3_WRP  [project net 3V3]
VT_EN_B: port VT_EN_BANK, sheet U_VT_WRP/VT_EN_WRP, sheet U_VT_WRP/VT_EN_WRP, sheet U_VT_WRP/VT_EN_WRP, sheet U_VT_WRP/VT_EN_WRP, sheet U_VT_WRP/VT_EN_WRP, sheet U_VT_WRP/VT_EN_WRP, sheet U_VT_WRP/VT_EN_WRP, sheet U_VT_WRP/VT_EN_WRP, sheet U_VT_WRP/VT_EN_WRP, sheet U_VT_WRP/VT_EN_WRP, sheet U_VT_WRP/VT_EN_WRP, sheet U_VT_WRP/VT_EN_WRP, sheet U_VT_WRP/VT_EN_WRP, sheet U_VT_WRP/VT_EN_WRP, sheet U_VT_WRP/VT_EN_WRP, sheet U_VT_WRP/VT_EN_WRP  [project net EN]
VT_VCC_B: port VT_VCC_BANK, sheet U_VT_WRP/VT_VCC_WRP, sheet U_VT_WRP/VT_VCC_WRP, sheet U_VT_WRP/VT_VCC_WRP, sheet U_VT_WRP/VT_VCC_WRP, sheet U_VT_WRP/VT_VCC_WRP, sheet U_VT_WRP/VT_VCC_WRP, sheet U_VT_WRP/VT_VCC_WRP, sheet U_VT_WRP/VT_VCC_WRP, sheet U_VT_WRP/VT_VCC_WRP, sheet U_VT_WRP/VT_VCC_WRP, sheet U_VT_WRP/VT_VCC_WRP, sheet U_VT_WRP/VT_VCC_WRP, sheet U_VT_WRP/VT_VCC_WRP, sheet U_VT_WRP/VT_VCC_WRP, sheet U_VT_WRP/VT_VCC_WRP, sheet U_VT_WRP/VT_VCC_WRP  [project net GLOBAL_HIGH_POWER]

### Buses and harness runs
bus IVCC_B[7..0] = port IVCC_BANK[7..0]
bus IVCC_B[7..0] = sheet U_VT_WRP/IVCC_WRP[7..0]
bus IVCC_B[15..8] = port IVCC_BANK[15..8]
bus IVCC_B[15..8] = sheet U_VT_WRP/IVCC_WRP[7..0]
bus IVCC_B[23..16] = port IVCC_BANK[23..16]
bus IVCC_B[23..16] = sheet U_VT_WRP/IVCC_WRP[7..0]
bus IVCC_B[31..24] = port IVCC_BANK[31..24]
bus IVCC_B[31..24] = sheet U_VT_WRP/IVCC_WRP[7..0]
bus IVCC_B[39..32] = port IVCC_BANK[39..32]
bus IVCC_B[39..32] = sheet U_VT_WRP/IVCC_WRP[7..0]
bus IVCC_B[47..40] = port IVCC_BANK[47..40]
bus IVCC_B[47..40] = sheet U_VT_WRP/IVCC_WRP[7..0]
bus IVCC_B[55..48] = port IVCC_BANK[55..48]
bus IVCC_B[55..48] = sheet U_VT_WRP/IVCC_WRP[7..0]
bus IVCC_B[63..56] = port IVCC_BANK[63..56]
bus IVCC_B[63..56] = sheet U_VT_WRP/IVCC_WRP[7..0]
bus IVCC_B[71..64] = port IVCC_BANK[71..64]
bus IVCC_B[71..64] = sheet U_VT_WRP/IVCC_WRP[7..0]
bus IVCC_B[79..72] = port IVCC_BANK[79..72]
bus IVCC_B[79..72] = sheet U_VT_WRP/IVCC_WRP[7..0]
bus IVCC_B[87..80] = port IVCC_BANK[87..80]
bus IVCC_B[87..80] = sheet U_VT_WRP/IVCC_WRP[7..0]
bus IVCC_B[95..88] = port IVCC_BANK[95..88]
bus IVCC_B[95..88] = sheet U_VT_WRP/IVCC_WRP[7..0]
bus IVCC_B[103..96] = port IVCC_BANK[103..96]
bus IVCC_B[103..96] = sheet U_VT_WRP/IVCC_WRP[7..0]
bus IVCC_B[111..104] = port IVCC_BANK[111..104]
bus IVCC_B[111..104] = sheet U_VT_WRP/IVCC_WRP[7..0]
bus IVCC_B[119..112] = port IVCC_BANK[119..112]
bus IVCC_B[119..112] = sheet U_VT_WRP/IVCC_WRP[7..0]
bus IVCC_B[127..120] = port IVCC_BANK[127..120]
bus IVCC_B[127..120] = sheet U_VT_WRP/IVCC_WRP[7..0]
bus OVL_B[7..0] = port OVL_BANK[7..0]
bus OVL_B[7..0] = sheet U_VT_WRP/OVL_WRP[7..0]
bus OVL_B[15..8] = port OVL_BANK[15..8]
bus OVL_B[15..8] = sheet U_VT_WRP/OVL_WRP[7..0]
bus OVL_B[23..16] = port OVL_BANK[23..16]
bus OVL_B[23..16] = sheet U_VT_WRP/OVL_WRP[7..0]
bus OVL_B[31..24] = port OVL_BANK[31..24]
bus OVL_B[31..24] = sheet U_VT_WRP/OVL_WRP[7..0]
bus OVL_B[39..32] = port OVL_BANK[39..32]
bus OVL_B[39..32] = sheet U_VT_WRP/OVL_WRP[7..0]
bus OVL_B[47..40] = port OVL_BANK[47..40]
bus OVL_B[47..40] = sheet U_VT_WRP/OVL_WRP[7..0]
bus OVL_B[55..48] = port OVL_BANK[55..48]
bus OVL_B[55..48] = sheet U_VT_WRP/OVL_WRP[7..0]
bus OVL_B[63..56] = port OVL_BANK[63..56]
bus OVL_B[63..56] = sheet U_VT_WRP/OVL_WRP[7..0]
bus OVL_B[71..64] = port OVL_BANK[71..64]
bus OVL_B[71..64] = sheet U_VT_WRP/OVL_WRP[7..0]
bus OVL_B[79..72] = port OVL_BANK[79..72]
bus OVL_B[79..72] = sheet U_VT_WRP/OVL_WRP[7..0]
bus OVL_B[87..80] = port OVL_BANK[87..80]
bus OVL_B[87..80] = sheet U_VT_WRP/OVL_WRP[7..0]
bus OVL_B[95..88] = port OVL_BANK[95..88]
bus OVL_B[95..88] = sheet U_VT_WRP/OVL_WRP[7..0]
bus OVL_B[103..96] = port OVL_BANK[103..96]
bus OVL_B[103..96] = sheet U_VT_WRP/OVL_WRP[7..0]
bus OVL_B[111..104] = port OVL_BANK[111..104]
bus OVL_B[111..104] = sheet U_VT_WRP/OVL_WRP[7..0]
bus OVL_B[119..112] = port OVL_BANK[119..112]
bus OVL_B[119..112] = sheet U_VT_WRP/OVL_WRP[7..0]
bus OVL_B[127..120] = port OVL_BANK[127..120]
bus OVL_B[127..120] = sheet U_VT_WRP/OVL_WRP[7..0]

## Sheet VT_WRP.SchDoc
size A; DocumentNumber: 4; SheetNumber: 4; SheetTotal: 13
Used 16 times, as channels U_VT_BANK/U_VT_WRP, U_VT_BANK/U_VT_WRP, U_VT_BANK/U_VT_WRP, U_VT_BANK/U_VT_WRP, U_VT_BANK/U_VT_WRP, U_VT_BANK/U_VT_WRP, U_VT_BANK/U_VT_WRP, U_VT_BANK/U_VT_WRP, U_VT_BANK/U_VT_WRP, U_VT_BANK/U_VT_WRP, U_VT_BANK/U_VT_WRP, U_VT_BANK/U_VT_WRP, U_VT_BANK/U_VT_WRP, U_VT_BANK/U_VT_WRP, U_VT_BANK/U_VT_WRP, U_VT_BANK/U_VT_WRP. Parts and nets are listed once, with the designators drawn on the sheet.
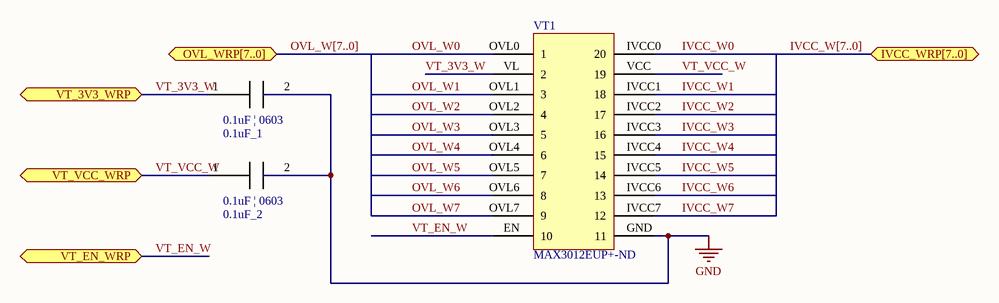
[diagram p4: VT_WRP.SchDoc]

### Parts
0.1uF_1  0.1uF_0603  [0.1uF_0603]  (value not drawn)
0.1uF_2  0.1uF_0603  [0.1uF_0603]  (value not drawn)
VT1  Supplier Part Number 1: MAX3012EUP+-ND  [VT_TSSOP20]  (hidden comment: MAX3012EUP+)

### Ports
IVCC_WRP[7..0], OVL_WRP[7..0], VT_3V3_WRP, VT_EN_WRP, VT_VCC_WRP

### Nets
GND: 0.1uF_1.2 0.1uF_2.2 VT1.GND(11)
IVCC_W0: VT1.IVCC0(20)
IVCC_W1: VT1.IVCC1(18)
IVCC_W2: VT1.IVCC2(17)
IVCC_W3: VT1.IVCC3(16)
IVCC_W4: VT1.IVCC4(15)
IVCC_W5: VT1.IVCC5(14)
IVCC_W6: VT1.IVCC6(13)
IVCC_W7: VT1.IVCC7(12)
OVL_W0: VT1.OVL0(1)
OVL_W1: VT1.OVL1(3)
OVL_W2: VT1.OVL2(4)
OVL_W3: VT1.OVL3(5)
OVL_W4: VT1.OVL4(6)
OVL_W5: VT1.OVL5(7)
OVL_W6: VT1.OVL6(8)
OVL_W7: VT1.OVL7(9)
VT_3V3_W: 0.1uF_1.1 VT1.VL(2) ; port VT_3V3_WRP
VT_EN_W: VT1.EN(10) ; port VT_EN_WRP
VT_VCC_W: 0.1uF_2.1 VT1.VCC(19) ; port VT_VCC_WRP

### Channels
U_VT_BANK/U_VT_WRP: designators 0.1uF_1=0.1uF_1#1 0.1uF_2=0.1uF_2#1 VT1=V14; ports VT_3V3_WRP=3V3 VT_EN_WRP=EN VT_VCC_WRP=GLOBAL_HIGH_POWER
U_VT_BANK/U_VT_WRP: designators 0.1uF_1=0.1uF_1#2 0.1uF_2=0.1uF_2#2 VT1=V13; ports VT_3V3_WRP=3V3 VT_EN_WRP=EN VT_VCC_WRP=GLOBAL_HIGH_POWER
U_VT_BANK/U_VT_WRP: designators 0.1uF_1=0.1uF_1#3 0.1uF_2=0.1uF_2#3 VT1=V16; ports VT_3V3_WRP=3V3 VT_EN_WRP=EN VT_VCC_WRP=GLOBAL_HIGH_POWER
U_VT_BANK/U_VT_WRP: designators 0.1uF_1=0.1uF_1#4 0.1uF_2=0.1uF_2#4 VT1=V15; ports VT_3V3_WRP=3V3 VT_EN_WRP=EN VT_VCC_WRP=GLOBAL_HIGH_POWER
U_VT_BANK/U_VT_WRP: designators 0.1uF_1=0.1uF_1#5 0.1uF_2=0.1uF_2#5 VT1=V12; ports VT_3V3_WRP=3V3 VT_EN_WRP=EN VT_VCC_WRP=GLOBAL_HIGH_POWER
U_VT_BANK/U_VT_WRP: designators 0.1uF_1=0.1uF_1#6 0.1uF_2=0.1uF_2#6 VT1=V11; ports VT_3V3_WRP=3V3 VT_EN_WRP=EN VT_VCC_WRP=GLOBAL_HIGH_POWER
U_VT_BANK/U_VT_WRP: designators 0.1uF_1=0.1uF_1#7 0.1uF_2=0.1uF_2#7 VT1=V10; ports VT_3V3_WRP=3V3 VT_EN_WRP=EN VT_VCC_WRP=GLOBAL_HIGH_POWER
U_VT_BANK/U_VT_WRP: designators 0.1uF_1=0.1uF_1#8 0.1uF_2=0.1uF_2#8 VT1=V9; ports VT_3V3_WRP=3V3 VT_EN_WRP=EN VT_VCC_WRP=GLOBAL_HIGH_POWER
U_VT_BANK/U_VT_WRP: designators 0.1uF_1=0.1uF_1#9 0.1uF_2=0.1uF_2#9 VT1=V8; ports VT_3V3_WRP=3V3 VT_EN_WRP=EN VT_VCC_WRP=GLOBAL_HIGH_POWER
U_VT_BANK/U_VT_WRP: designators 0.1uF_1=0.1uF_1#10 0.1uF_2=0.1uF_2#10 VT1=V7; ports VT_3V3_WRP=3V3 VT_EN_WRP=EN VT_VCC_WRP=GLOBAL_HIGH_POWER
U_VT_BANK/U_VT_WRP: designators 0.1uF_1=0.1uF_1#11 0.1uF_2=0.1uF_2#11 VT1=V6; ports VT_3V3_WRP=3V3 VT_EN_WRP=EN VT_VCC_WRP=GLOBAL_HIGH_POWER
U_VT_BANK/U_VT_WRP: designators 0.1uF_1=0.1uF_1#12 0.1uF_2=0.1uF_2#12 VT1=V5; ports VT_3V3_WRP=3V3 VT_EN_WRP=EN VT_VCC_WRP=GLOBAL_HIGH_POWER
U_VT_BANK/U_VT_WRP: designators 0.1uF_1=0.1uF_1#13 0.1uF_2=0.1uF_2#13 VT1=V4; ports VT_3V3_WRP=3V3 VT_EN_WRP=EN VT_VCC_WRP=GLOBAL_HIGH_POWER
U_VT_BANK/U_VT_WRP: designators 0.1uF_1=0.1uF_1_U_VT_BANK_U_VT_WRP#1 0.1uF_2=0.1uF_2#14 VT1=V3; ports VT_3V3_WRP=3V3 VT_EN_WRP=EN VT_VCC_WRP=GLOBAL_HIGH_POWER
U_VT_BANK/U_VT_WRP: designators 0.1uF_1=0.1uF_1_U_VT_BANK_U_VT_WRP#2 0.1uF_2=0.1uF_2#15 VT1=V2; ports VT_3V3_WRP=3V3 VT_EN_WRP=EN VT_VCC_WRP=GLOBAL_HIGH_POWER
U_VT_BANK/U_VT_WRP: designators 0.1uF_1=0.1uF_1#14 0.1uF_2=0.1uF_2#16 VT1=V1; ports VT_3V3_WRP=3V3 VT_EN_WRP=EN VT_VCC_WRP=GLOBAL_HIGH_POWER

### Buses and harness runs
bus IVCC_W[7..0] = port IVCC_WRP[7..0]
bus OVL_W[7..0] = port OVL_WRP[7..0]

### Notes on the sheet
- (in symbol 0.1uF_0603) 0.1uF | 0603

### Library data of the parts
VT1 = MAX3012EUP+: IC TRANSLATOR LEVEL 8CH 20-TSSOP; Manufacturer: Maxim Integrated; Translator Type: Voltage Level; Channel Type: Unidirectional; Number of Circuits: 1; Channels per Circuit: 8; Voltage - VCCA: 1.2 V ~ 5.5 V; Voltage - VCCB: 1.65 V ~ 5.5 V; Output Type: Tri-State, Non-Inverted; Data Rate: 35Mbps; Supplier 1: Digi-Key; Manufacturer Part Number: MAX3012EUP+; RoHS: RoHS Compliant; Category: Integrated Circuits (ICs); Stock 1: 297; Pricing 1: 1=3.17, 10=3.012, 25=2.81, 50=2.7668 (USD); Packaging: Tube; Input Signal: -; Output Signal: -; Operating Temperature: -40°C ~ 85°C (TA); Features: Power Supply Decoupling; Mounting Type: Surface Mount; Package / Case: 20-TSSOP (0.173", 4.40mm Width); Supplier Device Package: 20-TSSOP; ComponentLink1URL: http://datasheets.maximintegrated.com/en/ds/MAX3000E-MAX3012.pdf; ComponentLink1Description: http://datasheets.maximintegrated.com/en/ds/MAX3000E-MAX3012.pdf

## Sheet OB_BANK.SchDoc
size 508 x 254 mm; DocumentNumber: 8; SheetNumber: 8; SheetTotal: 13
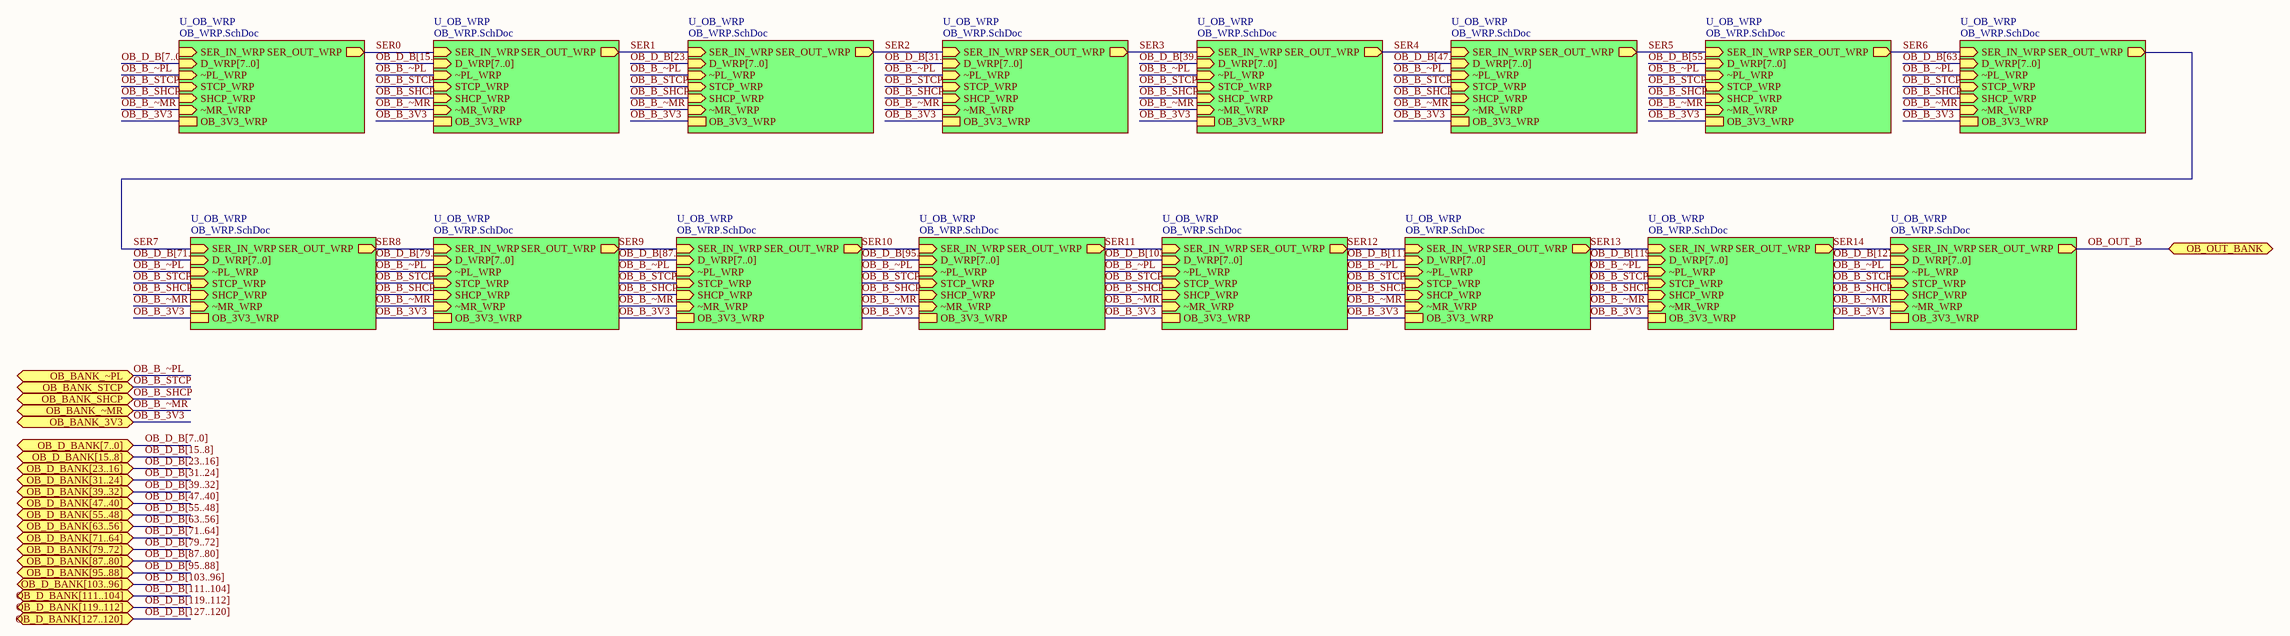
[diagram p5: OB_BANK.SchDoc]

### Sub-sheets
U_OB_WRP = OB_WRP.SchDoc: D_WRP[7..0], SER_OUT_WRP, SER_IN_WRP, ~PL_WRP, STCP_WRP, SHCP_WRP, ~MR_WRP, OB_3V3_WRP
U_OB_WRP = OB_WRP.SchDoc: D_WRP[7..0], SER_OUT_WRP, SER_IN_WRP, ~PL_WRP, STCP_WRP, SHCP_WRP, ~MR_WRP, OB_3V3_WRP
U_OB_WRP = OB_WRP.SchDoc: D_WRP[7..0], SER_OUT_WRP, SER_IN_WRP, ~PL_WRP, STCP_WRP, SHCP_WRP, ~MR_WRP, OB_3V3_WRP
U_OB_WRP = OB_WRP.SchDoc: D_WRP[7..0], SER_OUT_WRP, SER_IN_WRP, ~PL_WRP, STCP_WRP, SHCP_WRP, ~MR_WRP, OB_3V3_WRP
U_OB_WRP = OB_WRP.SchDoc: D_WRP[7..0], SER_OUT_WRP, SER_IN_WRP, ~PL_WRP, STCP_WRP, SHCP_WRP, ~MR_WRP, OB_3V3_WRP
U_OB_WRP = OB_WRP.SchDoc: D_WRP[7..0], SER_OUT_WRP, SER_IN_WRP, ~PL_WRP, STCP_WRP, SHCP_WRP, ~MR_WRP, OB_3V3_WRP
U_OB_WRP = OB_WRP.SchDoc: D_WRP[7..0], SER_OUT_WRP, SER_IN_WRP, ~PL_WRP, STCP_WRP, SHCP_WRP, ~MR_WRP, OB_3V3_WRP
U_OB_WRP = OB_WRP.SchDoc: D_WRP[7..0], SER_OUT_WRP, SER_IN_WRP, ~PL_WRP, STCP_WRP, SHCP_WRP, ~MR_WRP, OB_3V3_WRP
U_OB_WRP = OB_WRP.SchDoc: D_WRP[7..0], SER_OUT_WRP, SER_IN_WRP, ~PL_WRP, STCP_WRP, SHCP_WRP, ~MR_WRP, OB_3V3_WRP
U_OB_WRP = OB_WRP.SchDoc: D_WRP[7..0], SER_OUT_WRP, SER_IN_WRP, ~PL_WRP, STCP_WRP, SHCP_WRP, ~MR_WRP, OB_3V3_WRP
U_OB_WRP = OB_WRP.SchDoc: D_WRP[7..0], SER_OUT_WRP, SER_IN_WRP, ~PL_WRP, STCP_WRP, SHCP_WRP, ~MR_WRP, OB_3V3_WRP
U_OB_WRP = OB_WRP.SchDoc: D_WRP[7..0], SER_OUT_WRP, SER_IN_WRP, ~PL_WRP, STCP_WRP, SHCP_WRP, ~MR_WRP, OB_3V3_WRP
U_OB_WRP = OB_WRP.SchDoc: D_WRP[7..0], SER_OUT_WRP, SER_IN_WRP, ~PL_WRP, STCP_WRP, SHCP_WRP, ~MR_WRP, OB_3V3_WRP
U_OB_WRP = OB_WRP.SchDoc: D_WRP[7..0], SER_OUT_WRP, SER_IN_WRP, ~PL_WRP, STCP_WRP, SHCP_WRP, ~MR_WRP, OB_3V3_WRP
U_OB_WRP = OB_WRP.SchDoc: D_WRP[7..0], SER_OUT_WRP, SER_IN_WRP, ~PL_WRP, STCP_WRP, SHCP_WRP, ~MR_WRP, OB_3V3_WRP
U_OB_WRP = OB_WRP.SchDoc: D_WRP[7..0], SER_OUT_WRP, SER_IN_WRP, ~PL_WRP, STCP_WRP, SHCP_WRP, ~MR_WRP, OB_3V3_WRP

### Ports
OB_BANK_3V3, OB_BANK_SHCP, OB_BANK_STCP, OB_BANK_~MR, OB_BANK_~PL, OB_D_BANK[7..0], OB_D_BANK[15..8], OB_D_BANK[23..16], OB_D_BANK[31..24], OB_D_BANK[39..32], OB_D_BANK[47..40], OB_D_BANK[55..48], OB_D_BANK[63..56], OB_D_BANK[71..64], OB_D_BANK[79..72], OB_D_BANK[87..80], OB_D_BANK[95..88], OB_D_BANK[103..96], OB_D_BANK[111..104], OB_D_BANK[119..112], OB_D_BANK[127..120], OB_OUT_BANK

### Nets
OB_B_3V3: port OB_BANK_3V3, sheet U_OB_WRP/OB_3V3_WRP, sheet U_OB_WRP/OB_3V3_WRP, sheet U_OB_WRP/OB_3V3_WRP, sheet U_OB_WRP/OB_3V3_WRP, sheet U_OB_WRP/OB_3V3_WRP, sheet U_OB_WRP/OB_3V3_WRP, sheet U_OB_WRP/OB_3V3_WRP, sheet U_OB_WRP/OB_3V3_WRP, sheet U_OB_WRP/OB_3V3_WRP, sheet U_OB_WRP/OB_3V3_WRP, sheet U_OB_WRP/OB_3V3_WRP, sheet U_OB_WRP/OB_3V3_WRP, sheet U_OB_WRP/OB_3V3_WRP, sheet U_OB_WRP/OB_3V3_WRP, sheet U_OB_WRP/OB_3V3_WRP, sheet U_OB_WRP/OB_3V3_WRP  [project net 3V3]
OB_B_SHCP: port OB_BANK_SHCP, sheet U_OB_WRP/SHCP_WRP, sheet U_OB_WRP/SHCP_WRP, sheet U_OB_WRP/SHCP_WRP, sheet U_OB_WRP/SHCP_WRP, sheet U_OB_WRP/SHCP_WRP, sheet U_OB_WRP/SHCP_WRP, sheet U_OB_WRP/SHCP_WRP, sheet U_OB_WRP/SHCP_WRP, sheet U_OB_WRP/SHCP_WRP, sheet U_OB_WRP/SHCP_WRP, sheet U_OB_WRP/SHCP_WRP, sheet U_OB_WRP/SHCP_WRP, sheet U_OB_WRP/SHCP_WRP, sheet U_OB_WRP/SHCP_WRP, sheet U_OB_WRP/SHCP_WRP, sheet U_OB_WRP/SHCP_WRP  [project net FPGA_SHCP]
OB_B_STCP: port OB_BANK_STCP, sheet U_OB_WRP/STCP_WRP, sheet U_OB_WRP/STCP_WRP, sheet U_OB_WRP/STCP_WRP, sheet U_OB_WRP/STCP_WRP, sheet U_OB_WRP/STCP_WRP, sheet U_OB_WRP/STCP_WRP, sheet U_OB_WRP/STCP_WRP, sheet U_OB_WRP/STCP_WRP, sheet U_OB_WRP/STCP_WRP, sheet U_OB_WRP/STCP_WRP, sheet U_OB_WRP/STCP_WRP, sheet U_OB_WRP/STCP_WRP, sheet U_OB_WRP/STCP_WRP, sheet U_OB_WRP/STCP_WRP, sheet U_OB_WRP/STCP_WRP, sheet U_OB_WRP/STCP_WRP  [project net FPGA_STCP]
OB_B_~MR: port OB_BANK_~MR, sheet U_OB_WRP/~MR_WRP, sheet U_OB_WRP/~MR_WRP, sheet U_OB_WRP/~MR_WRP, sheet U_OB_WRP/~MR_WRP, sheet U_OB_WRP/~MR_WRP, sheet U_OB_WRP/~MR_WRP, sheet U_OB_WRP/~MR_WRP, sheet U_OB_WRP/~MR_WRP, sheet U_OB_WRP/~MR_WRP, sheet U_OB_WRP/~MR_WRP, sheet U_OB_WRP/~MR_WRP, sheet U_OB_WRP/~MR_WRP, sheet U_OB_WRP/~MR_WRP, sheet U_OB_WRP/~MR_WRP, sheet U_OB_WRP/~MR_WRP, sheet U_OB_WRP/~MR_WRP  [project net FPGA_~MR]
OB_B_~PL: port OB_BANK_~PL, sheet U_OB_WRP/~PL_WRP, sheet U_OB_WRP/~PL_WRP, sheet U_OB_WRP/~PL_WRP, sheet U_OB_WRP/~PL_WRP, sheet U_OB_WRP/~PL_WRP, sheet U_OB_WRP/~PL_WRP, sheet U_OB_WRP/~PL_WRP, sheet U_OB_WRP/~PL_WRP, sheet U_OB_WRP/~PL_WRP, sheet U_OB_WRP/~PL_WRP, sheet U_OB_WRP/~PL_WRP, sheet U_OB_WRP/~PL_WRP, sheet U_OB_WRP/~PL_WRP, sheet U_OB_WRP/~PL_WRP, sheet U_OB_WRP/~PL_WRP, sheet U_OB_WRP/~PL_WRP  [project net FPGA_~PL]
OB_OUT_B: port OB_OUT_BANK, sheet U_OB_WRP/SER_OUT_WRP  [project net FPGA_Q]
SER0: sheet U_OB_WRP/SER_OUT_WRP, sheet U_OB_WRP/SER_IN_WRP
SER1: sheet U_OB_WRP/SER_OUT_WRP, sheet U_OB_WRP/SER_IN_WRP
SER2: sheet U_OB_WRP/SER_OUT_WRP, sheet U_OB_WRP/SER_IN_WRP
SER3: sheet U_OB_WRP/SER_OUT_WRP, sheet U_OB_WRP/SER_IN_WRP
SER4: sheet U_OB_WRP/SER_OUT_WRP, sheet U_OB_WRP/SER_IN_WRP
SER5: sheet U_OB_WRP/SER_OUT_WRP, sheet U_OB_WRP/SER_IN_WRP
SER6: sheet U_OB_WRP/SER_OUT_WRP, sheet U_OB_WRP/SER_IN_WRP
SER7: sheet U_OB_WRP/SER_OUT_WRP, sheet U_OB_WRP/SER_IN_WRP
SER8: sheet U_OB_WRP/SER_OUT_WRP, sheet U_OB_WRP/SER_IN_WRP
SER9: sheet U_OB_WRP/SER_OUT_WRP, sheet U_OB_WRP/SER_IN_WRP
SER10: sheet U_OB_WRP/SER_OUT_WRP, sheet U_OB_WRP/SER_IN_WRP
SER11: sheet U_OB_WRP/SER_OUT_WRP, sheet U_OB_WRP/SER_IN_WRP
SER12: sheet U_OB_WRP/SER_OUT_WRP, sheet U_OB_WRP/SER_IN_WRP
SER13: sheet U_OB_WRP/SER_OUT_WRP, sheet U_OB_WRP/SER_IN_WRP
SER14: sheet U_OB_WRP/SER_OUT_WRP, sheet U_OB_WRP/SER_IN_WRP

### Buses and harness runs
bus OB_D_B[7..0] = port OB_D_BANK[7..0]
bus OB_D_B[7..0] = sheet U_OB_WRP/D_WRP[7..0]
bus OB_D_B[15..8] = port OB_D_BANK[15..8]
bus OB_D_B[15..8] = sheet U_OB_WRP/D_WRP[7..0]
bus OB_D_B[23..16] = port OB_D_BANK[23..16]
bus OB_D_B[23..16] = sheet U_OB_WRP/D_WRP[7..0]
bus OB_D_B[31..24] = port OB_D_BANK[31..24]
bus OB_D_B[31..24] = sheet U_OB_WRP/D_WRP[7..0]
bus OB_D_B[39..32] = port OB_D_BANK[39..32]
bus OB_D_B[39..32] = sheet U_OB_WRP/D_WRP[7..0]
bus OB_D_B[47..40] = port OB_D_BANK[47..40]
bus OB_D_B[47..40] = sheet U_OB_WRP/D_WRP[7..0]
bus OB_D_B[55..48] = port OB_D_BANK[55..48]
bus OB_D_B[55..48] = sheet U_OB_WRP/D_WRP[7..0]
bus OB_D_B[63..56] = port OB_D_BANK[63..56]
bus OB_D_B[63..56] = sheet U_OB_WRP/D_WRP[7..0]
bus OB_D_B[71..64] = port OB_D_BANK[71..64]
bus OB_D_B[71..64] = sheet U_OB_WRP/D_WRP[7..0]
bus OB_D_B[79..72] = port OB_D_BANK[79..72]
bus OB_D_B[79..72] = sheet U_OB_WRP/D_WRP[7..0]
bus OB_D_B[87..80] = port OB_D_BANK[87..80]
bus OB_D_B[87..80] = sheet U_OB_WRP/D_WRP[7..0]
bus OB_D_B[95..88] = port OB_D_BANK[95..88]
bus OB_D_B[95..88] = sheet U_OB_WRP/D_WRP[7..0]
bus OB_D_B[103..96] = port OB_D_BANK[103..96]
bus OB_D_B[103..96] = sheet U_OB_WRP/D_WRP[7..0]
bus OB_D_B[111..104] = port OB_D_BANK[111..104]
bus OB_D_B[111..104] = sheet U_OB_WRP/D_WRP[7..0]
bus OB_D_B[119..112] = port OB_D_BANK[119..112]
bus OB_D_B[119..112] = sheet U_OB_WRP/D_WRP[7..0]
bus OB_D_B[127..120] = port OB_D_BANK[127..120]
bus OB_D_B[127..120] = sheet U_OB_WRP/D_WRP[7..0]

## Sheet OB_WRP.SchDoc
size A; DocumentNumber: 7; SheetNumber: 7; SheetTotal: 13
Used 16 times, as channels U_OB_BANK/U_OB_WRP, U_OB_BANK/U_OB_WRP, U_OB_BANK/U_OB_WRP, U_OB_BANK/U_OB_WRP, U_OB_BANK/U_OB_WRP, U_OB_BANK/U_OB_WRP, U_OB_BANK/U_OB_WRP, U_OB_BANK/U_OB_WRP, U_OB_BANK/U_OB_WRP, U_OB_BANK/U_OB_WRP, U_OB_BANK/U_OB_WRP, U_OB_BANK/U_OB_WRP, U_OB_BANK/U_OB_WRP, U_OB_BANK/U_OB_WRP, U_OB_BANK/U_OB_WRP, U_OB_BANK/U_OB_WRP. Parts and nets are listed once, with the designators drawn on the sheet.
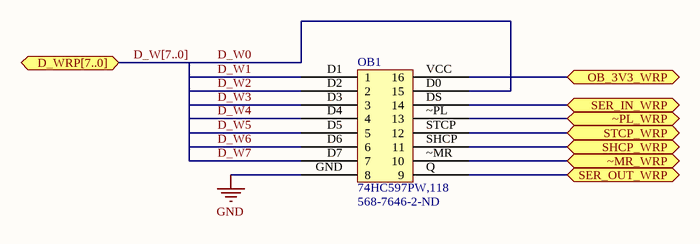
[diagram p6: OB_WRP.SchDoc]

### Parts
OB1  74HC597PW,118  Supplier Part Number 1: 568-7646-2-ND  [OB_TSSOP16]

### Ports
D_WRP[7..0], OB_3V3_WRP, SER_IN_WRP, SER_OUT_WRP, SHCP_WRP, STCP_WRP, ~MR_WRP, ~PL_WRP

### Nets
GND: OB1.GND(8)
D_W0: OB1.D0(15)
D_W1: OB1.D1(1)
D_W2: OB1.D2(2)
D_W3: OB1.D3(3)
D_W4: OB1.D4(4)
D_W5: OB1.D5(5)
D_W6: OB1.D6(6)
D_W7: OB1.D7(7)
OB_3V3_WRP: OB1.VCC(16) ; port OB_3V3_WRP
SER_IN_WRP: OB1.DS(14) ; port SER_IN_WRP
SER_OUT_WRP: OB1.Q(9) ; port SER_OUT_WRP
SHCP_WRP: OB1.SHCP(11) ; port SHCP_WRP
STCP_WRP: OB1.STCP(12) ; port STCP_WRP
~MR_WRP: OB1.~MR(10) ; port ~MR_WRP
~PL_WRP: OB1.~PL(13) ; port ~PL_WRP

### Channels
U_OB_BANK/U_OB_WRP: designators end in 6; ports OB_3V3_WRP=3V3 SER_IN_WRP=NetOB16_DS SER_OUT_WRP=SER0 SHCP_WRP=FPGA_SHCP STCP_WRP=FPGA_STCP ~MR_WRP=FPGA_~MR ~PL_WRP=FPGA_~PL
U_OB_BANK/U_OB_WRP: designators end in 5; ports OB_3V3_WRP=3V3 SER_IN_WRP=SER0 SER_OUT_WRP=SER1 SHCP_WRP=FPGA_SHCP STCP_WRP=FPGA_STCP ~MR_WRP=FPGA_~MR ~PL_WRP=FPGA_~PL
U_OB_BANK/U_OB_WRP: designators end in 4; ports OB_3V3_WRP=3V3 SER_IN_WRP=SER1 SER_OUT_WRP=SER2 SHCP_WRP=FPGA_SHCP STCP_WRP=FPGA_STCP ~MR_WRP=FPGA_~MR ~PL_WRP=FPGA_~PL
U_OB_BANK/U_OB_WRP: designators end in 3; ports OB_3V3_WRP=3V3 SER_IN_WRP=SER2 SER_OUT_WRP=SER3 SHCP_WRP=FPGA_SHCP STCP_WRP=FPGA_STCP ~MR_WRP=FPGA_~MR ~PL_WRP=FPGA_~PL
U_OB_BANK/U_OB_WRP: designators end in 2; ports OB_3V3_WRP=3V3 SER_IN_WRP=SER3 SER_OUT_WRP=SER4 SHCP_WRP=FPGA_SHCP STCP_WRP=FPGA_STCP ~MR_WRP=FPGA_~MR ~PL_WRP=FPGA_~PL
U_OB_BANK/U_OB_WRP: designators end in 1; ports OB_3V3_WRP=3V3 SER_IN_WRP=SER4 SER_OUT_WRP=SER5 SHCP_WRP=FPGA_SHCP STCP_WRP=FPGA_STCP ~MR_WRP=FPGA_~MR ~PL_WRP=FPGA_~PL
U_OB_BANK/U_OB_WRP: designators end in 0; ports OB_3V3_WRP=3V3 SER_IN_WRP=SER5 SER_OUT_WRP=SER6 SHCP_WRP=FPGA_SHCP STCP_WRP=FPGA_STCP ~MR_WRP=FPGA_~MR ~PL_WRP=FPGA_~PL
U_OB_BANK/U_OB_WRP: designators OB1=OB9; ports OB_3V3_WRP=3V3 SER_IN_WRP=SER6 SER_OUT_WRP=SER7 SHCP_WRP=FPGA_SHCP STCP_WRP=FPGA_STCP ~MR_WRP=FPGA_~MR ~PL_WRP=FPGA_~PL
U_OB_BANK/U_OB_WRP: designators OB1=OB8; ports OB_3V3_WRP=3V3 SER_IN_WRP=SER7 SER_OUT_WRP=SER8 SHCP_WRP=FPGA_SHCP STCP_WRP=FPGA_STCP ~MR_WRP=FPGA_~MR ~PL_WRP=FPGA_~PL
U_OB_BANK/U_OB_WRP: designators OB1=OB7; ports OB_3V3_WRP=3V3 SER_IN_WRP=SER8 SER_OUT_WRP=SER9 SHCP_WRP=FPGA_SHCP STCP_WRP=FPGA_STCP ~MR_WRP=FPGA_~MR ~PL_WRP=FPGA_~PL
U_OB_BANK/U_OB_WRP: designators OB1=OB6; ports OB_3V3_WRP=3V3 SER_IN_WRP=SER9 SER_OUT_WRP=SER10 SHCP_WRP=FPGA_SHCP STCP_WRP=FPGA_STCP ~MR_WRP=FPGA_~MR ~PL_WRP=FPGA_~PL
U_OB_BANK/U_OB_WRP: designators OB1=OB5; ports OB_3V3_WRP=3V3 SER_IN_WRP=SER10 SER_OUT_WRP=SER11 SHCP_WRP=FPGA_SHCP STCP_WRP=FPGA_STCP ~MR_WRP=FPGA_~MR ~PL_WRP=FPGA_~PL
U_OB_BANK/U_OB_WRP: designators OB1=OB4; ports OB_3V3_WRP=3V3 SER_IN_WRP=SER11 SER_OUT_WRP=SER12 SHCP_WRP=FPGA_SHCP STCP_WRP=FPGA_STCP ~MR_WRP=FPGA_~MR ~PL_WRP=FPGA_~PL
U_OB_BANK/U_OB_WRP: designators OB1=OB3; ports OB_3V3_WRP=3V3 SER_IN_WRP=SER12 SER_OUT_WRP=SER13 SHCP_WRP=FPGA_SHCP STCP_WRP=FPGA_STCP ~MR_WRP=FPGA_~MR ~PL_WRP=FPGA_~PL
U_OB_BANK/U_OB_WRP: designators OB1=OB2; ports OB_3V3_WRP=3V3 SER_IN_WRP=SER13 SER_OUT_WRP=SER14 SHCP_WRP=FPGA_SHCP STCP_WRP=FPGA_STCP ~MR_WRP=FPGA_~MR ~PL_WRP=FPGA_~PL
U_OB_BANK/U_OB_WRP: ports OB_3V3_WRP=3V3 SER_IN_WRP=SER14 SER_OUT_WRP=FPGA_Q SHCP_WRP=FPGA_SHCP STCP_WRP=FPGA_STCP ~MR_WRP=FPGA_~MR ~PL_WRP=FPGA_~PL

### Buses and harness runs
bus D_W[7..0] = port D_WRP[7..0]

### Library data of the parts
OB1 = 74HC597PW,118: IC 8BIT SHIFT REGISTER 16TSSOP; Manufacturer: NXP Semiconductors; Output Type: Push-Pull; Number of Elements: 1; Number of Bits per Element: 8; Function: Parallel to Serial; Voltage - Supply: 2 V ~ 6 V; Supplier 1: Digi-Key; Manufacturer Part Number: 74HC597PW,118; RoHS: RoHS Compliant; Category: Integrated Circuits (ICs); Stock 1: 7500; Pricing 1: 2500=0.20506, 5000=0.19184, 12500=0.1786, 25000=0.16934, 62500=0.16538, 125000=0.15876 (USD); Packaging: Tape & Reel (TR); Logic Type: Shift Register; Operating Temperature: -40°C ~ 125°C; Mounting Type: Surface Mount; Package / Case: 16-TSSOP (0.173", 4.40mm Width); Supplier Device Package: 16-TSSOP; ComponentLink1URL: http://www.nxp.com/documents/data_sheet/74HC_HCT597.pdf; ComponentLink1Description: http://www.nxp.com/documents/data_sheet/74HC_HCT597.pdf

## Sheet SRAM_BANK.SchDoc
size 127 x 304 mm; DocumentNumber: 2; SheetNumber: 2; SheetTotal: 13
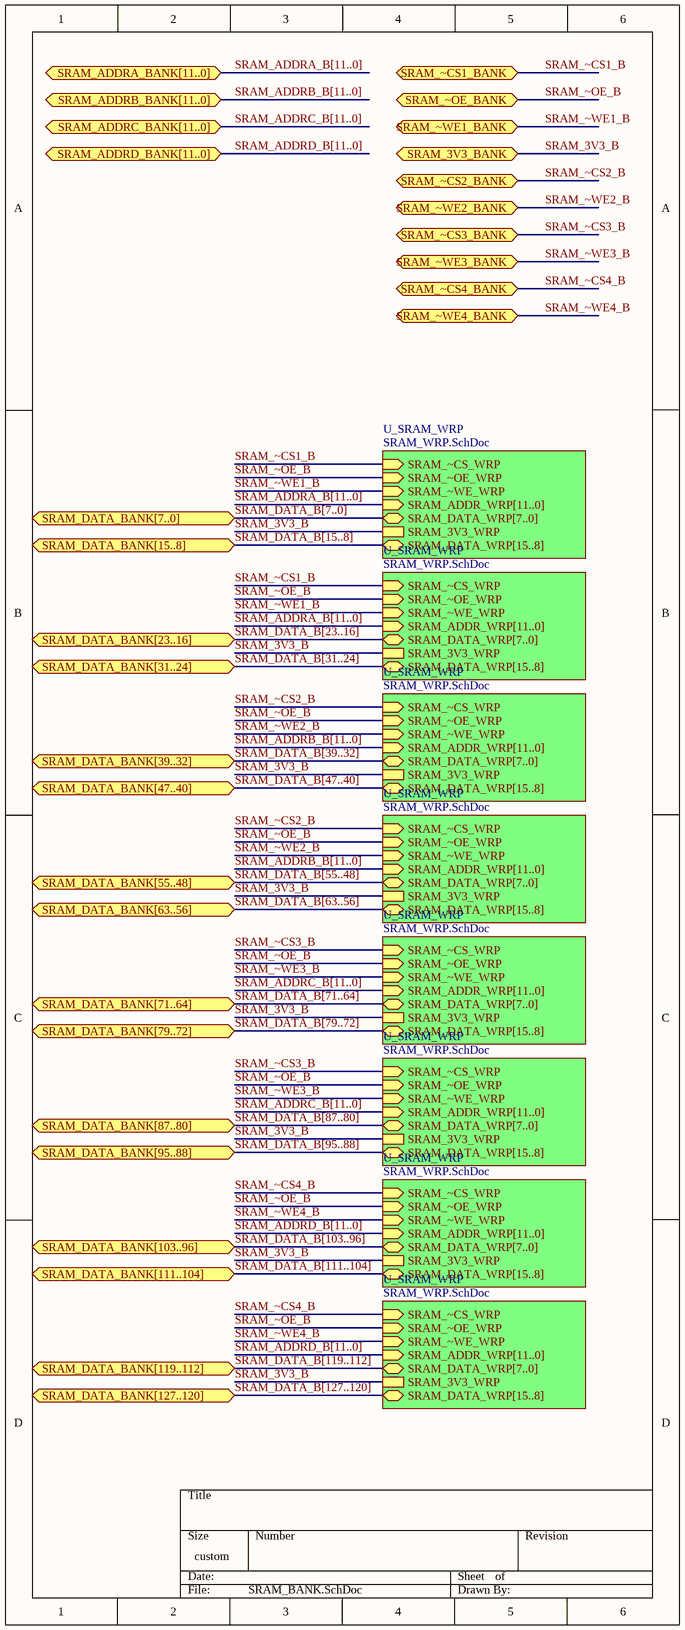
[diagram p7: SRAM_BANK.SchDoc]

### Sub-sheets
U_SRAM_WRP = SRAM_WRP.SchDoc: SRAM_~CS_WRP, SRAM_~OE_WRP, SRAM_~WE_WRP, SRAM_ADDR_WRP[11..0], SRAM_DATA_WRP[7..0], SRAM_3V3_WRP, SRAM_DATA_WRP[15..8]
U_SRAM_WRP = SRAM_WRP.SchDoc: SRAM_~CS_WRP, SRAM_~OE_WRP, SRAM_~WE_WRP, SRAM_ADDR_WRP[11..0], SRAM_DATA_WRP[7..0], SRAM_3V3_WRP, SRAM_DATA_WRP[15..8]
U_SRAM_WRP = SRAM_WRP.SchDoc: SRAM_~CS_WRP, SRAM_~OE_WRP, SRAM_~WE_WRP, SRAM_ADDR_WRP[11..0], SRAM_DATA_WRP[7..0], SRAM_3V3_WRP, SRAM_DATA_WRP[15..8]
U_SRAM_WRP = SRAM_WRP.SchDoc: SRAM_~CS_WRP, SRAM_~OE_WRP, SRAM_~WE_WRP, SRAM_ADDR_WRP[11..0], SRAM_DATA_WRP[7..0], SRAM_3V3_WRP, SRAM_DATA_WRP[15..8]
U_SRAM_WRP = SRAM_WRP.SchDoc: SRAM_~CS_WRP, SRAM_~OE_WRP, SRAM_~WE_WRP, SRAM_ADDR_WRP[11..0], SRAM_DATA_WRP[7..0], SRAM_3V3_WRP, SRAM_DATA_WRP[15..8]
U_SRAM_WRP = SRAM_WRP.SchDoc: SRAM_~CS_WRP, SRAM_~OE_WRP, SRAM_~WE_WRP, SRAM_ADDR_WRP[11..0], SRAM_DATA_WRP[7..0], SRAM_3V3_WRP, SRAM_DATA_WRP[15..8]
U_SRAM_WRP = SRAM_WRP.SchDoc: SRAM_~CS_WRP, SRAM_~OE_WRP, SRAM_~WE_WRP, SRAM_ADDR_WRP[11..0], SRAM_DATA_WRP[7..0], SRAM_3V3_WRP, SRAM_DATA_WRP[15..8]
U_SRAM_WRP = SRAM_WRP.SchDoc: SRAM_~CS_WRP, SRAM_~OE_WRP, SRAM_~WE_WRP, SRAM_ADDR_WRP[11..0], SRAM_DATA_WRP[7..0], SRAM_3V3_WRP, SRAM_DATA_WRP[15..8]

### Ports
SRAM_3V3_BANK, SRAM_ADDRA_BANK[11..0], SRAM_ADDRB_BANK[11..0], SRAM_ADDRC_BANK[11..0], SRAM_ADDRD_BANK[11..0], SRAM_DATA_BANK[7..0], SRAM_DATA_BANK[15..8], SRAM_DATA_BANK[23..16], SRAM_DATA_BANK[31..24], SRAM_DATA_BANK[39..32], SRAM_DATA_BANK[47..40], SRAM_DATA_BANK[55..48], SRAM_DATA_BANK[63..56], SRAM_DATA_BANK[71..64], SRAM_DATA_BANK[79..72], SRAM_DATA_BANK[87..80], SRAM_DATA_BANK[95..88], SRAM_DATA_BANK[103..96], SRAM_DATA_BANK[111..104], SRAM_DATA_BANK[119..112], SRAM_DATA_BANK[127..120], SRAM_~CS1_BANK, SRAM_~CS2_BANK, SRAM_~CS3_BANK, SRAM_~CS4_BANK, SRAM_~OE_BANK, SRAM_~WE1_BANK, SRAM_~WE2_BANK, SRAM_~WE3_BANK, SRAM_~WE4_BANK

### Nets
SRAM_3V3_B: port SRAM_3V3_BANK, sheet U_SRAM_WRP/SRAM_3V3_WRP, sheet U_SRAM_WRP/SRAM_3V3_WRP, sheet U_SRAM_WRP/SRAM_3V3_WRP, sheet U_SRAM_WRP/SRAM_3V3_WRP, sheet U_SRAM_WRP/SRAM_3V3_WRP, sheet U_SRAM_WRP/SRAM_3V3_WRP, sheet U_SRAM_WRP/SRAM_3V3_WRP, sheet U_SRAM_WRP/SRAM_3V3_WRP  [project net 3V3]
SRAM_~CS1_B: port SRAM_~CS1_BANK, sheet U_SRAM_WRP/SRAM_~CS_WRP, sheet U_SRAM_WRP/SRAM_~CS_WRP  [project net FPGA_~CS1]
SRAM_~CS2_B: port SRAM_~CS2_BANK, sheet U_SRAM_WRP/SRAM_~CS_WRP, sheet U_SRAM_WRP/SRAM_~CS_WRP  [project net FPGA_~CS2]
SRAM_~CS3_B: port SRAM_~CS3_BANK, sheet U_SRAM_WRP/SRAM_~CS_WRP, sheet U_SRAM_WRP/SRAM_~CS_WRP  [project net FPGA_~CS3]
SRAM_~CS4_B: port SRAM_~CS4_BANK, sheet U_SRAM_WRP/SRAM_~CS_WRP, sheet U_SRAM_WRP/SRAM_~CS_WRP  [project net FPGA_~CS4]
SRAM_~OE_B: port SRAM_~OE_BANK, sheet U_SRAM_WRP/SRAM_~OE_WRP, sheet U_SRAM_WRP/SRAM_~OE_WRP, sheet U_SRAM_WRP/SRAM_~OE_WRP, sheet U_SRAM_WRP/SRAM_~OE_WRP, sheet U_SRAM_WRP/SRAM_~OE_WRP, sheet U_SRAM_WRP/SRAM_~OE_WRP, sheet U_SRAM_WRP/SRAM_~OE_WRP, sheet U_SRAM_WRP/SRAM_~OE_WRP  [project net FPGA_~OE]
SRAM_~WE1_B: port SRAM_~WE1_BANK, sheet U_SRAM_WRP/SRAM_~WE_WRP, sheet U_SRAM_WRP/SRAM_~WE_WRP  [project net FPGA_~WE1]
SRAM_~WE2_B: port SRAM_~WE2_BANK, sheet U_SRAM_WRP/SRAM_~WE_WRP, sheet U_SRAM_WRP/SRAM_~WE_WRP  [project net FPGA_~WE2]
SRAM_~WE3_B: port SRAM_~WE3_BANK, sheet U_SRAM_WRP/SRAM_~WE_WRP, sheet U_SRAM_WRP/SRAM_~WE_WRP  [project net FPGA_~WE3]
SRAM_~WE4_B: port SRAM_~WE4_BANK, sheet U_SRAM_WRP/SRAM_~WE_WRP, sheet U_SRAM_WRP/SRAM_~WE_WRP  [project net FPGA_~WE4]

### Buses and harness runs
bus SRAM_ADDRA_B[11..0] = port SRAM_ADDRA_BANK[11..0]
bus SRAM_ADDRA_B[11..0] = sheet U_SRAM_WRP/SRAM_ADDR_WRP[11..0]
bus SRAM_ADDRB_B[11..0] = port SRAM_ADDRB_BANK[11..0]
bus SRAM_ADDRB_B[11..0] = sheet U_SRAM_WRP/SRAM_ADDR_WRP[11..0]
bus SRAM_ADDRC_B[11..0] = port SRAM_ADDRC_BANK[11..0]
bus SRAM_ADDRC_B[11..0] = sheet U_SRAM_WRP/SRAM_ADDR_WRP[11..0]
bus SRAM_ADDRD_B[11..0] = port SRAM_ADDRD_BANK[11..0]
bus SRAM_ADDRD_B[11..0] = sheet U_SRAM_WRP/SRAM_ADDR_WRP[11..0]
bus SRAM_DATA_B[7..0] = port SRAM_DATA_BANK[7..0] = sheet U_SRAM_WRP/SRAM_DATA_WRP[7..0]
bus SRAM_DATA_B[15..8] = port SRAM_DATA_BANK[15..8] = sheet U_SRAM_WRP/SRAM_DATA_WRP[15..8]
bus SRAM_DATA_B[23..16] = port SRAM_DATA_BANK[23..16] = sheet U_SRAM_WRP/SRAM_DATA_WRP[7..0]
bus SRAM_DATA_B[31..24] = port SRAM_DATA_BANK[31..24] = sheet U_SRAM_WRP/SRAM_DATA_WRP[15..8]
bus SRAM_DATA_B[39..32] = port SRAM_DATA_BANK[39..32] = sheet U_SRAM_WRP/SRAM_DATA_WRP[7..0]
bus SRAM_DATA_B[47..40] = port SRAM_DATA_BANK[47..40] = sheet U_SRAM_WRP/SRAM_DATA_WRP[15..8]
bus SRAM_DATA_B[55..48] = port SRAM_DATA_BANK[55..48] = sheet U_SRAM_WRP/SRAM_DATA_WRP[7..0]
bus SRAM_DATA_B[63..56] = port SRAM_DATA_BANK[63..56] = sheet U_SRAM_WRP/SRAM_DATA_WRP[15..8]
bus SRAM_DATA_B[71..64] = port SRAM_DATA_BANK[71..64] = sheet U_SRAM_WRP/SRAM_DATA_WRP[7..0]
bus SRAM_DATA_B[79..72] = port SRAM_DATA_BANK[79..72] = sheet U_SRAM_WRP/SRAM_DATA_WRP[15..8]
bus SRAM_DATA_B[87..80] = port SRAM_DATA_BANK[87..80] = sheet U_SRAM_WRP/SRAM_DATA_WRP[7..0]
bus SRAM_DATA_B[95..88] = port SRAM_DATA_BANK[95..88] = sheet U_SRAM_WRP/SRAM_DATA_WRP[15..8]
bus SRAM_DATA_B[103..96] = port SRAM_DATA_BANK[103..96] = sheet U_SRAM_WRP/SRAM_DATA_WRP[7..0]
bus SRAM_DATA_B[111..104] = port SRAM_DATA_BANK[111..104] = sheet U_SRAM_WRP/SRAM_DATA_WRP[15..8]
bus SRAM_DATA_B[119..112] = port SRAM_DATA_BANK[119..112] = sheet U_SRAM_WRP/SRAM_DATA_WRP[7..0]
bus SRAM_DATA_B[127..120] = port SRAM_DATA_BANK[127..120] = sheet U_SRAM_WRP/SRAM_DATA_WRP[15..8]